# EasyEDA Pro project ZYNQ7020核心板配套底板1.0.epro, schematic 底板原理图

## Sheets
1 PWR: Board Name: 核心板底板1.0; Create Date: 2025-05-13; Page Name: PWR; Project Name: ZYNQ7020核心板配套底板1.0; Schematic Name: 底板原理图; Update Date: 2025-05-18; Company: 嘉立创EDA; Page Size: A4; Version: V1.0
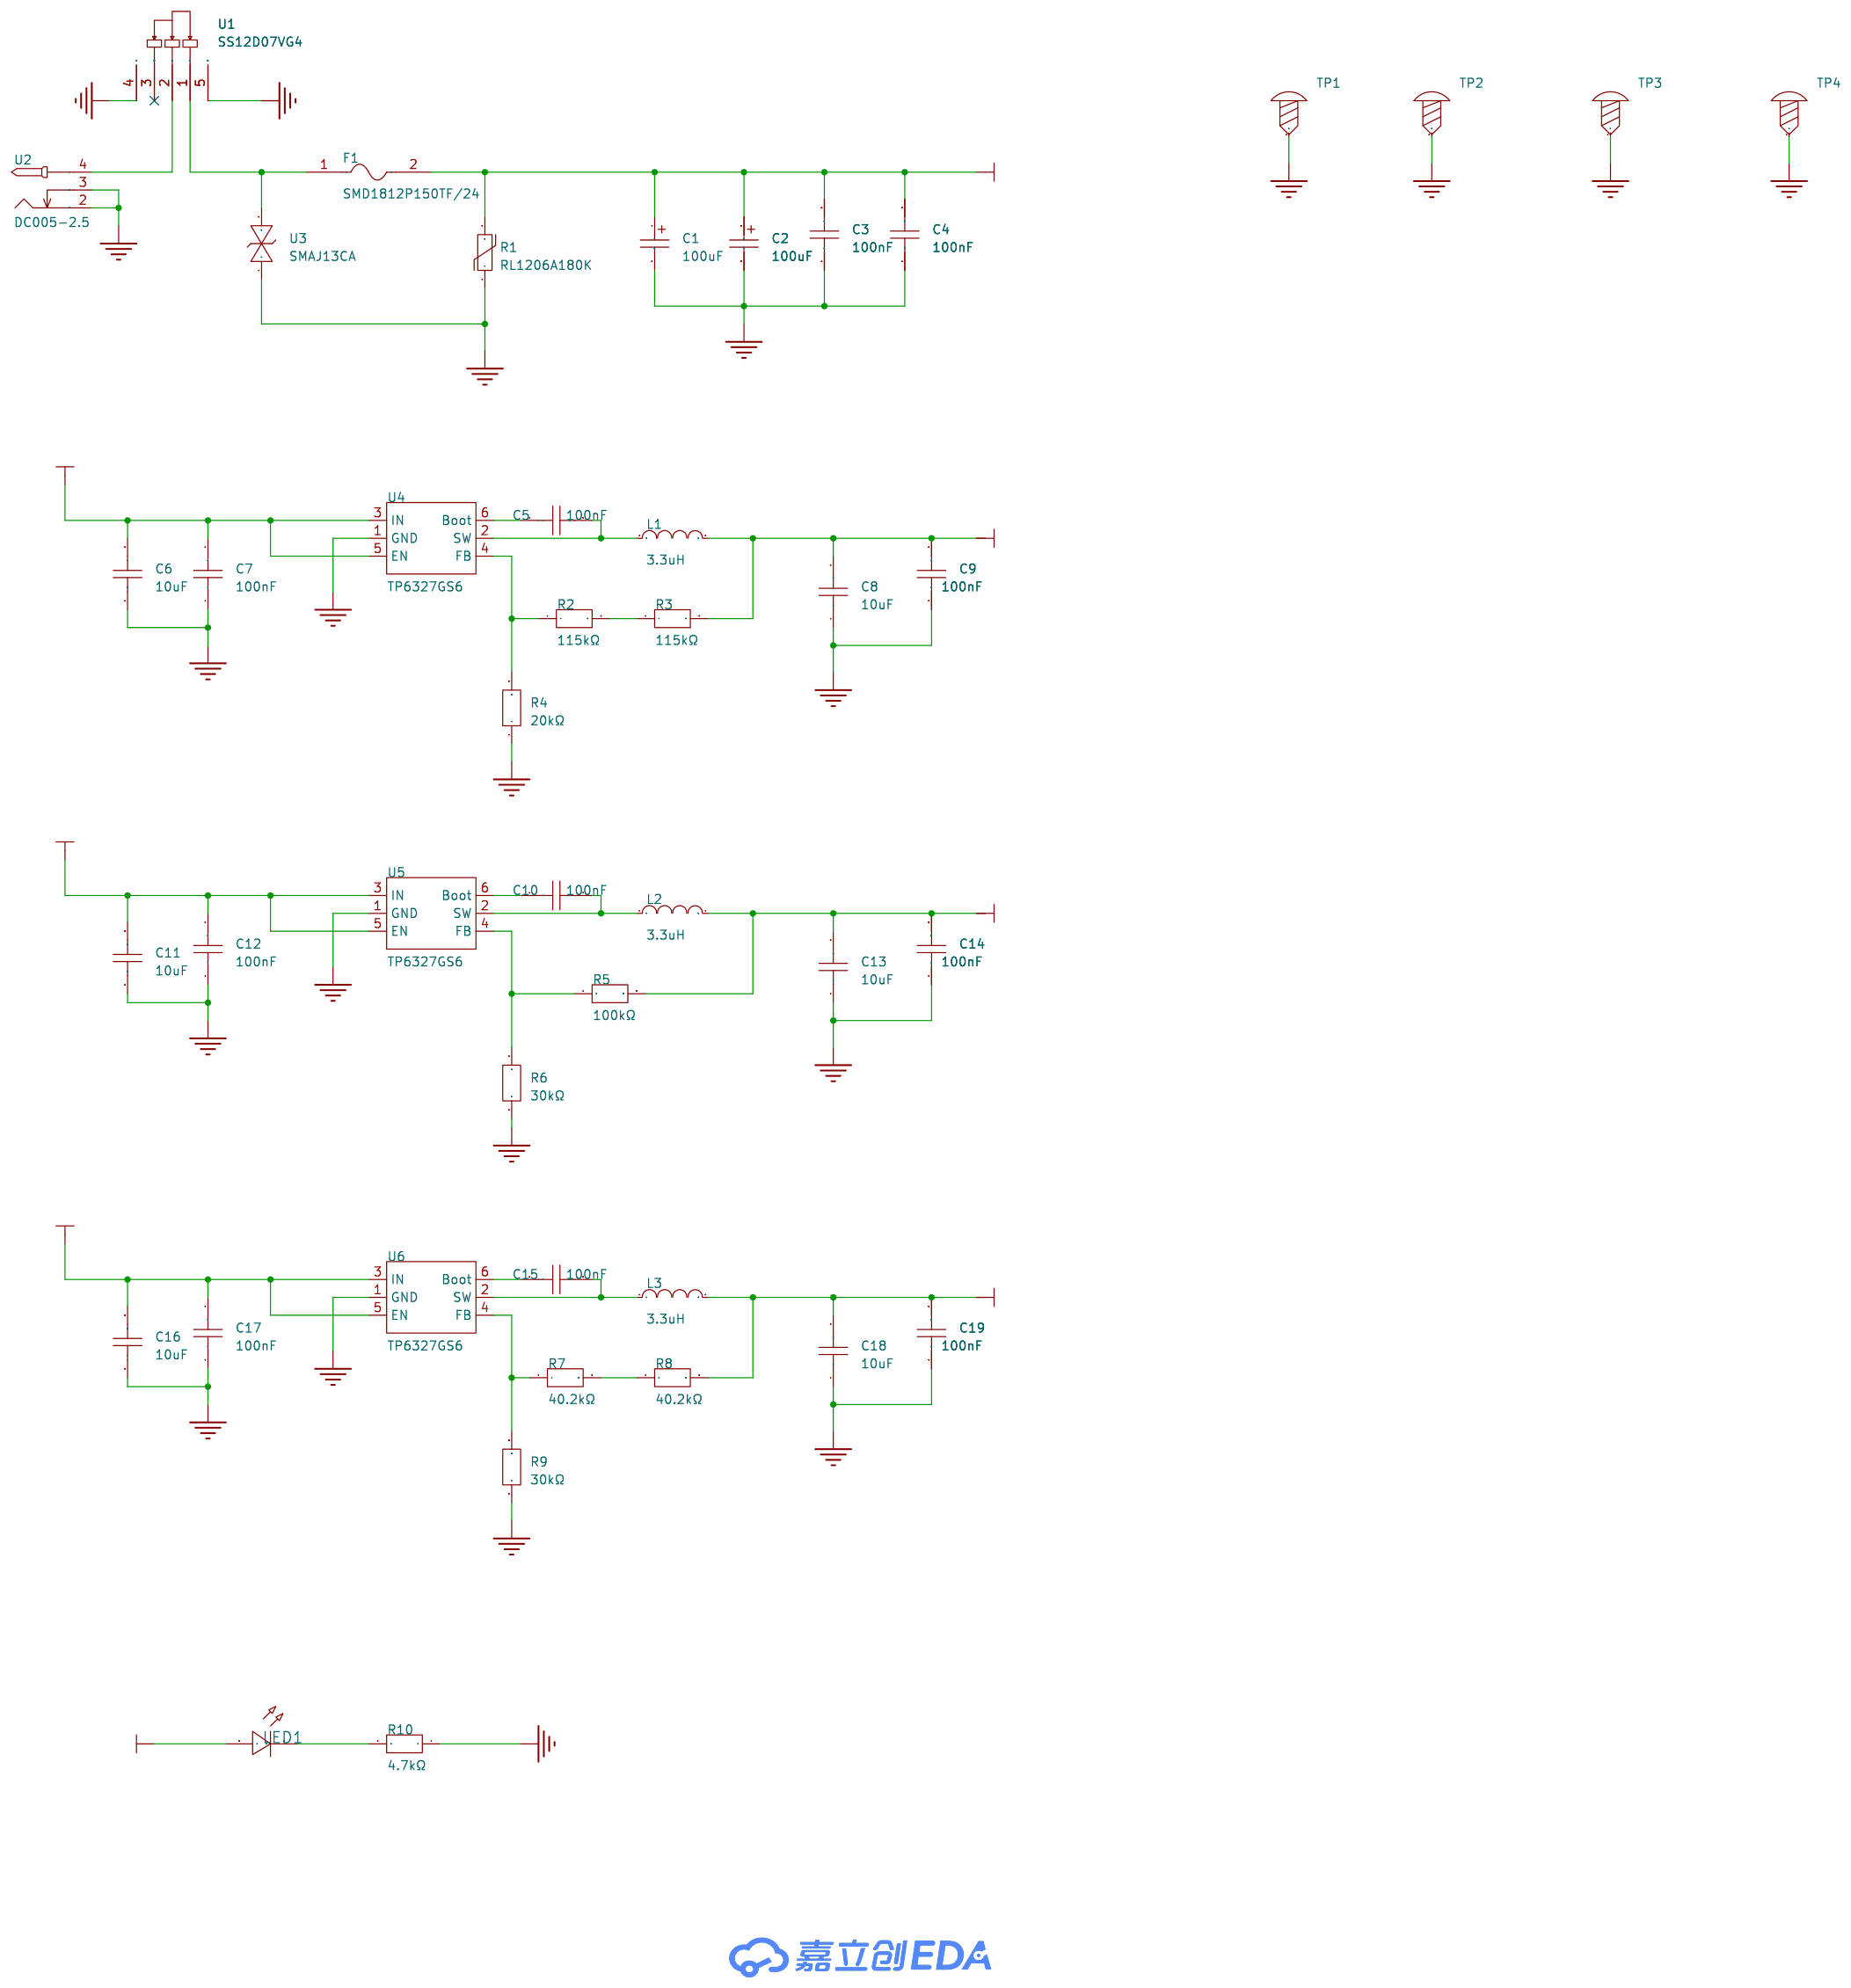
[diagram p0: PWR]
2 esp32: Page Name: esp32; Update Date: 2025-05-19; Company: 知行创新实验室; Drawed: zhz
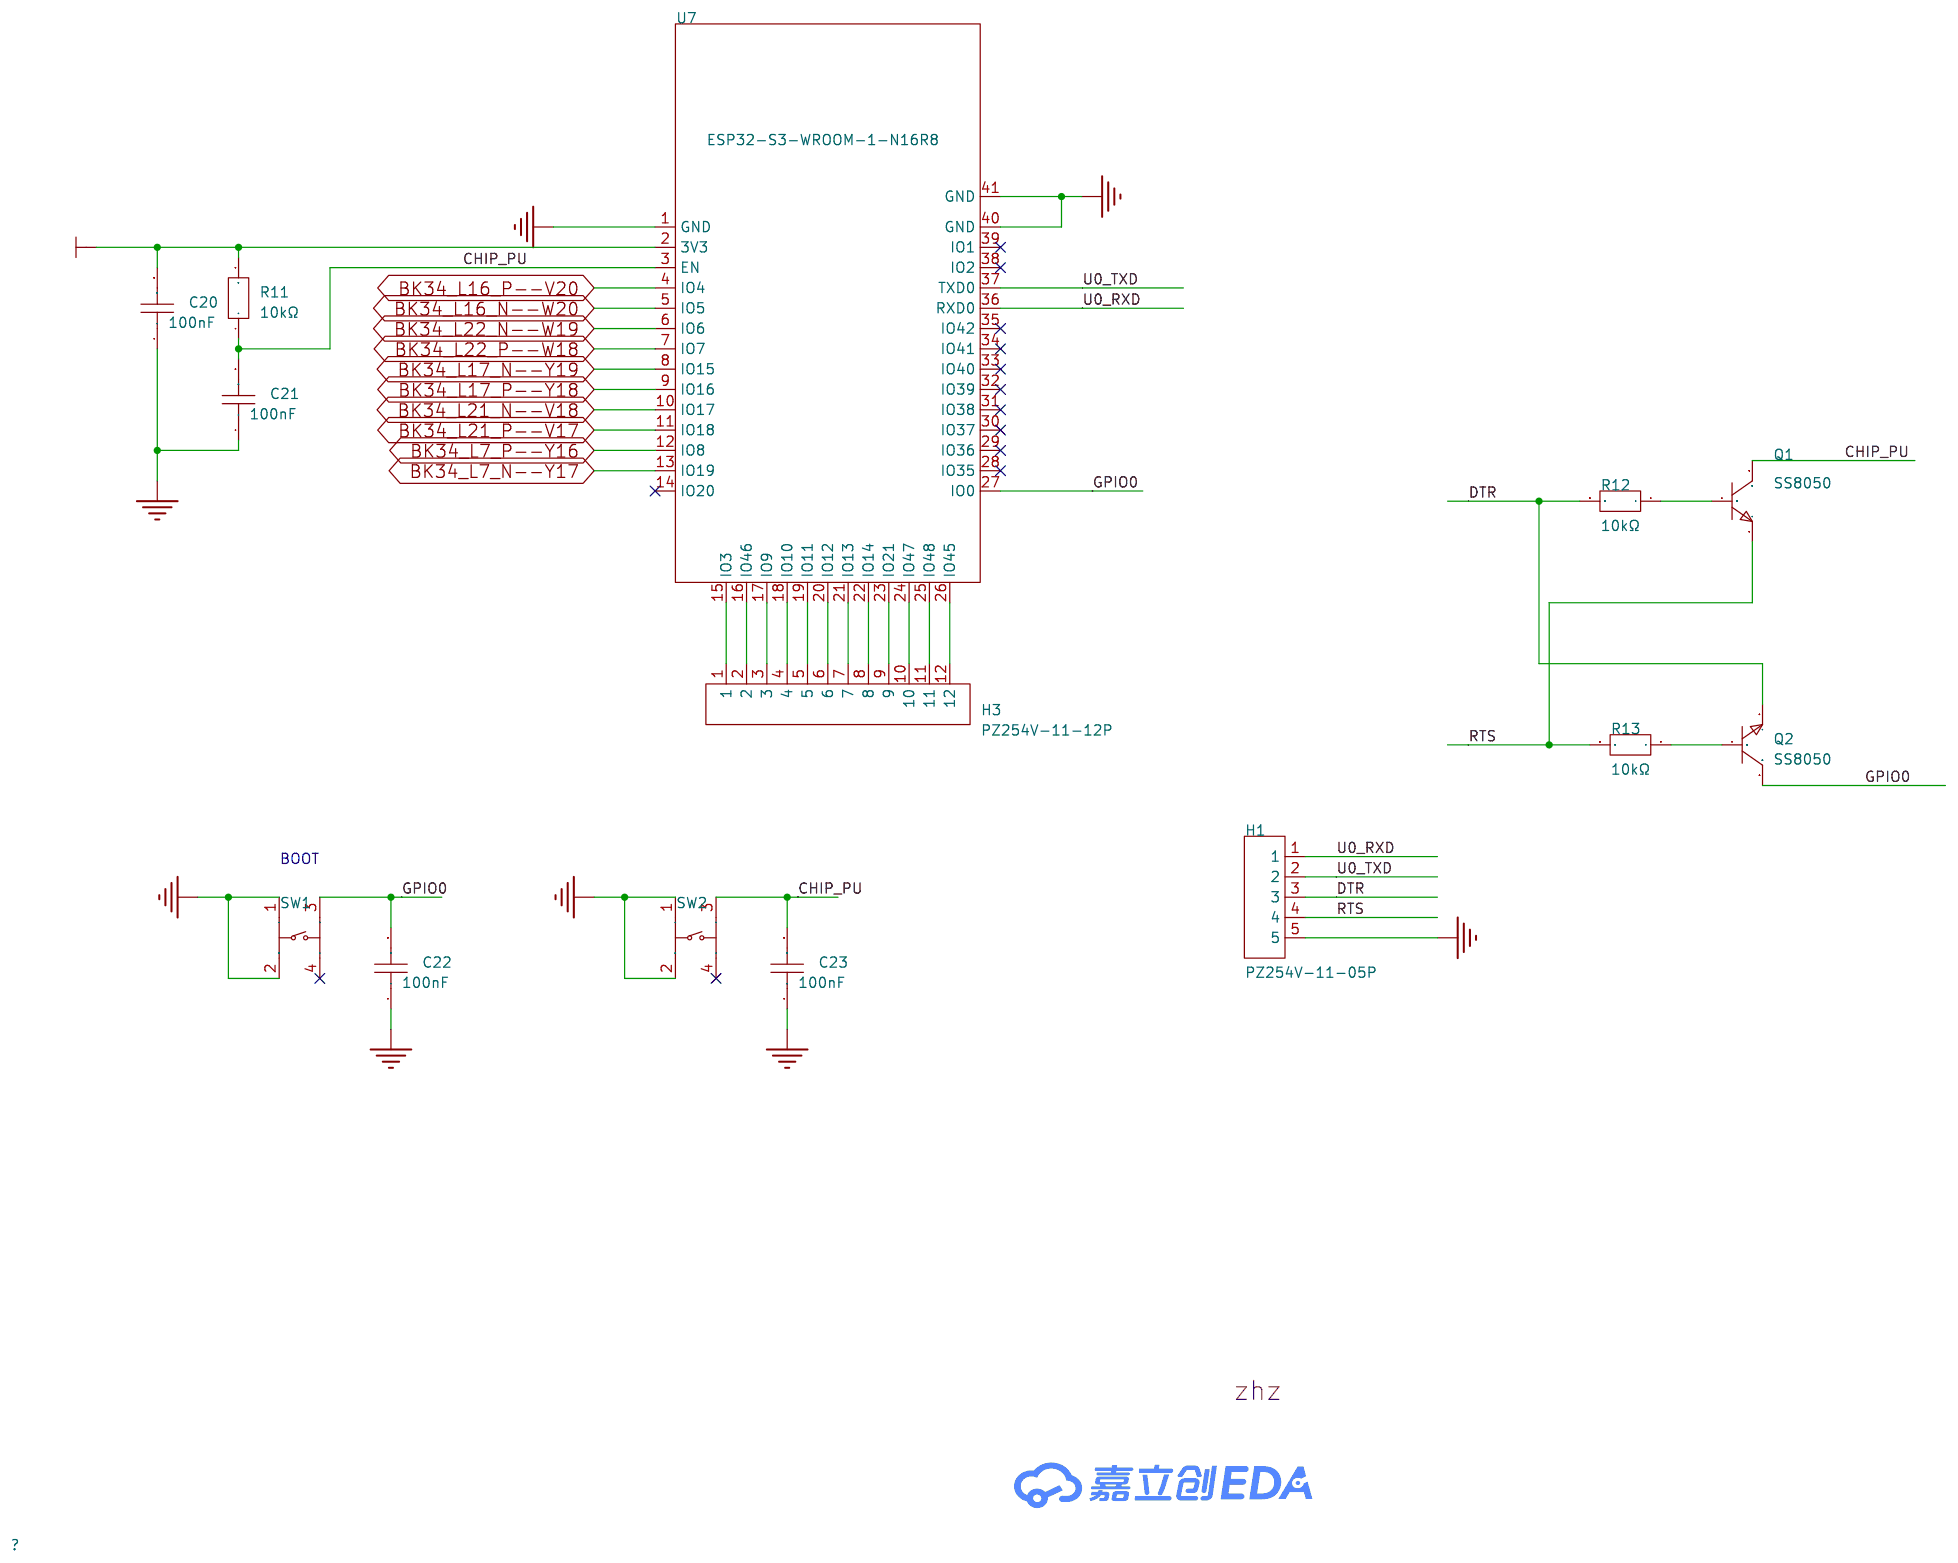
[diagram p1: esp32]
3 zynq: Page Name: zynq; Update Date: 2025-05-19
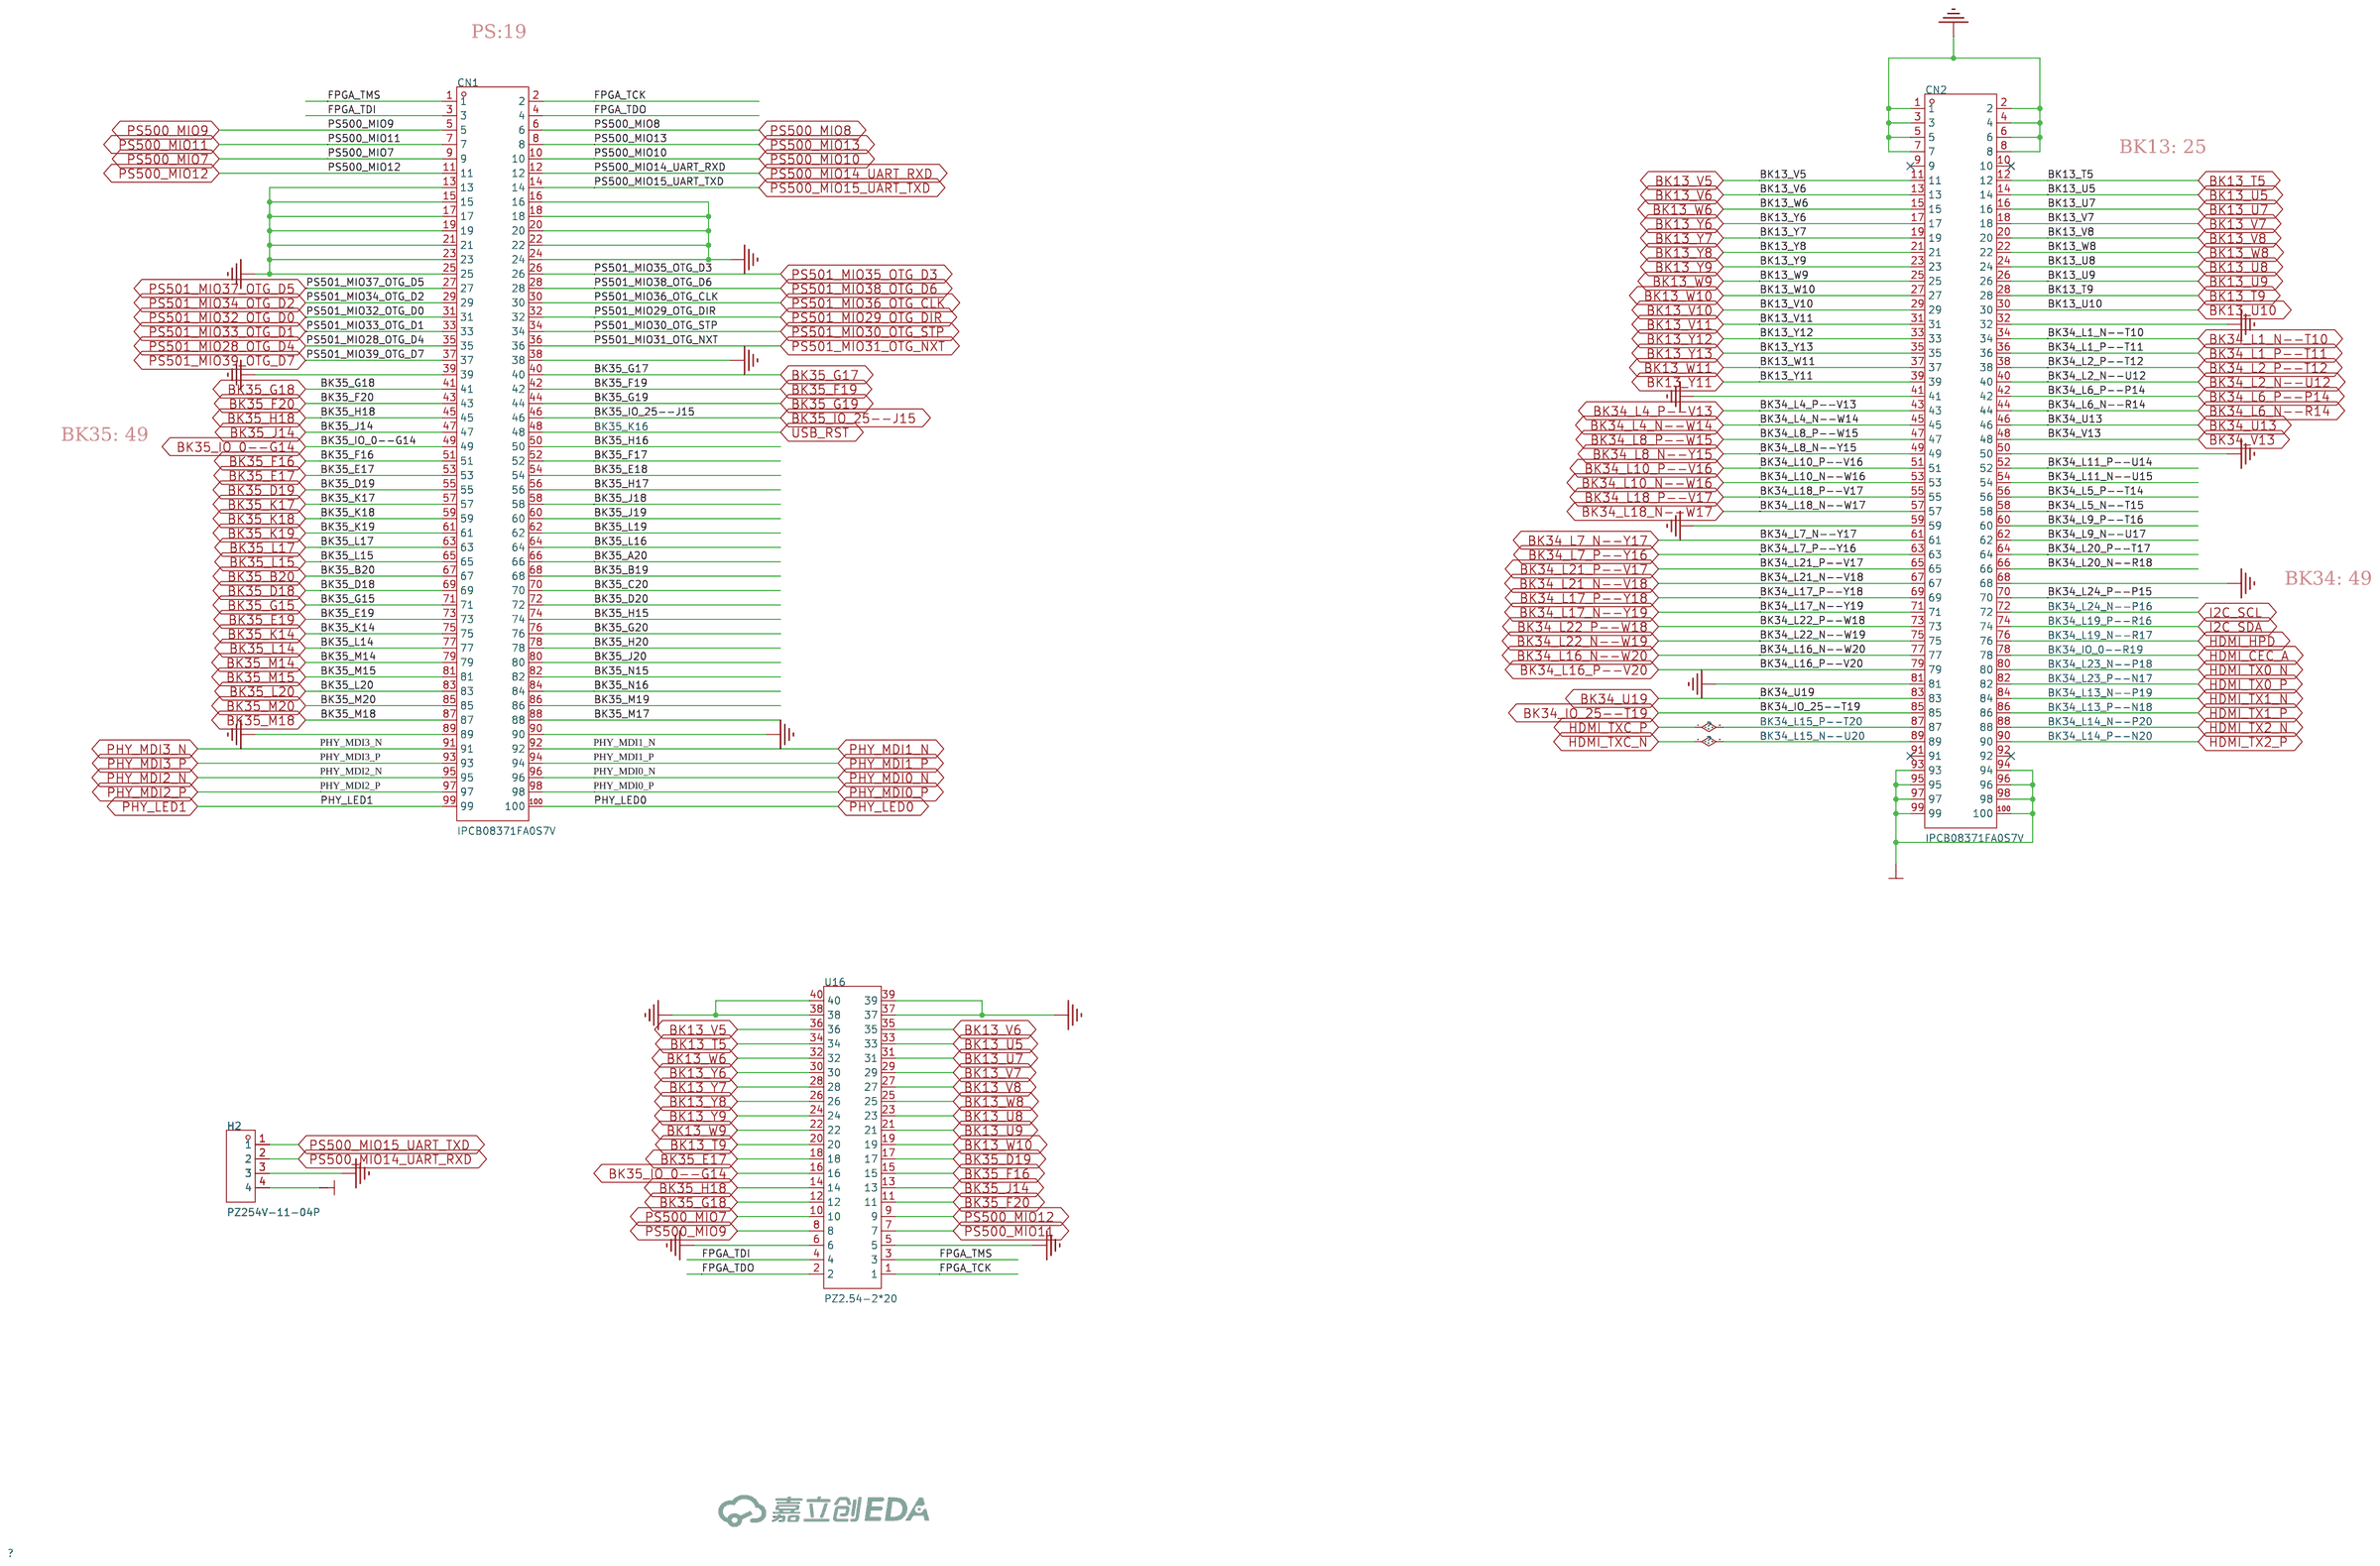
[diagram p2: zynq]
4 eth: Page Name: eth; Update Date: 2025-05-13
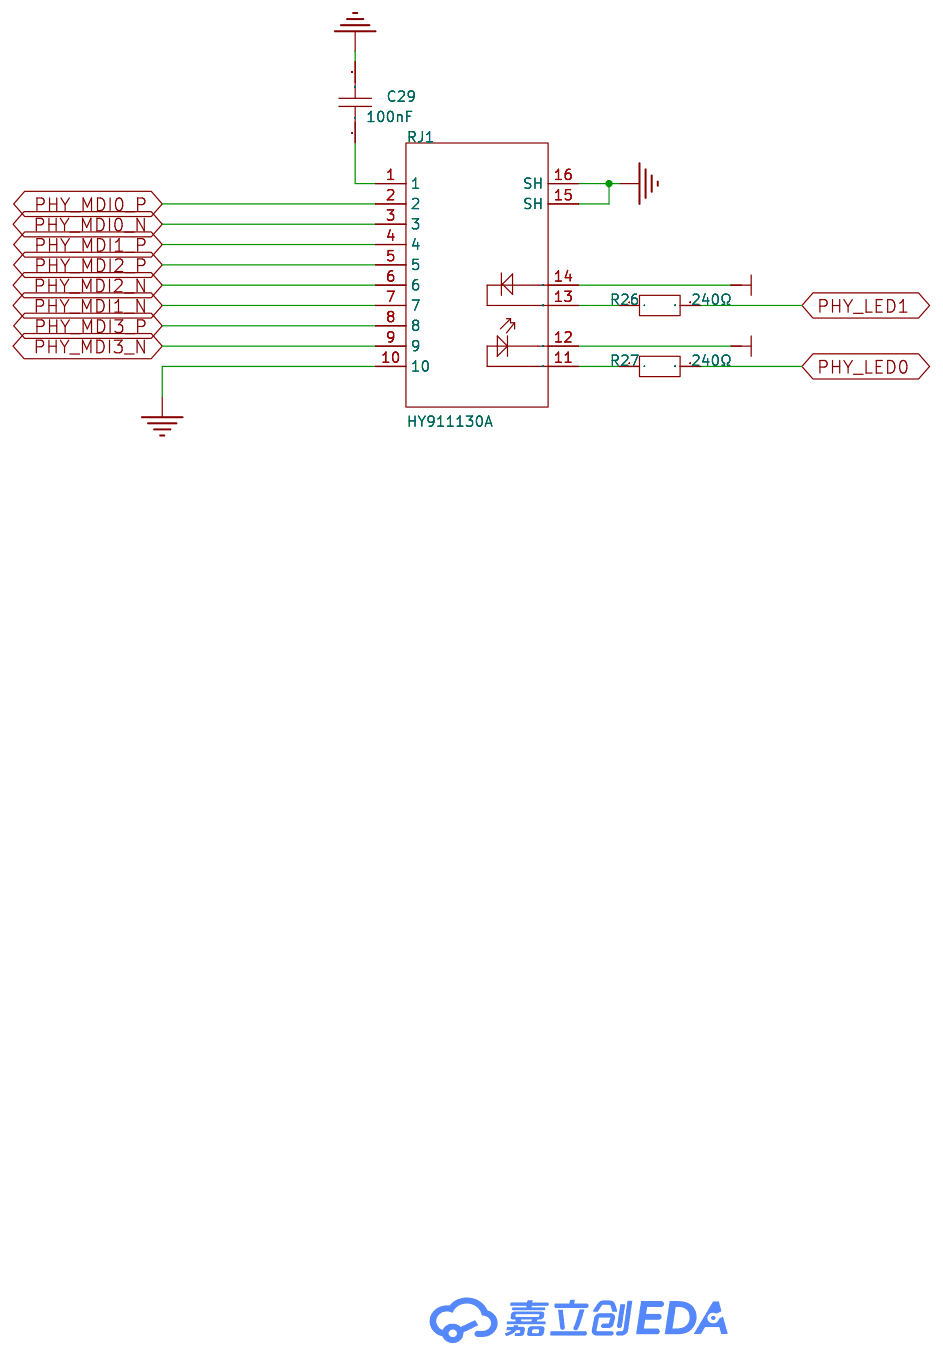
[diagram p3: eth]
5 usb2.0: Page Name: usb2.0
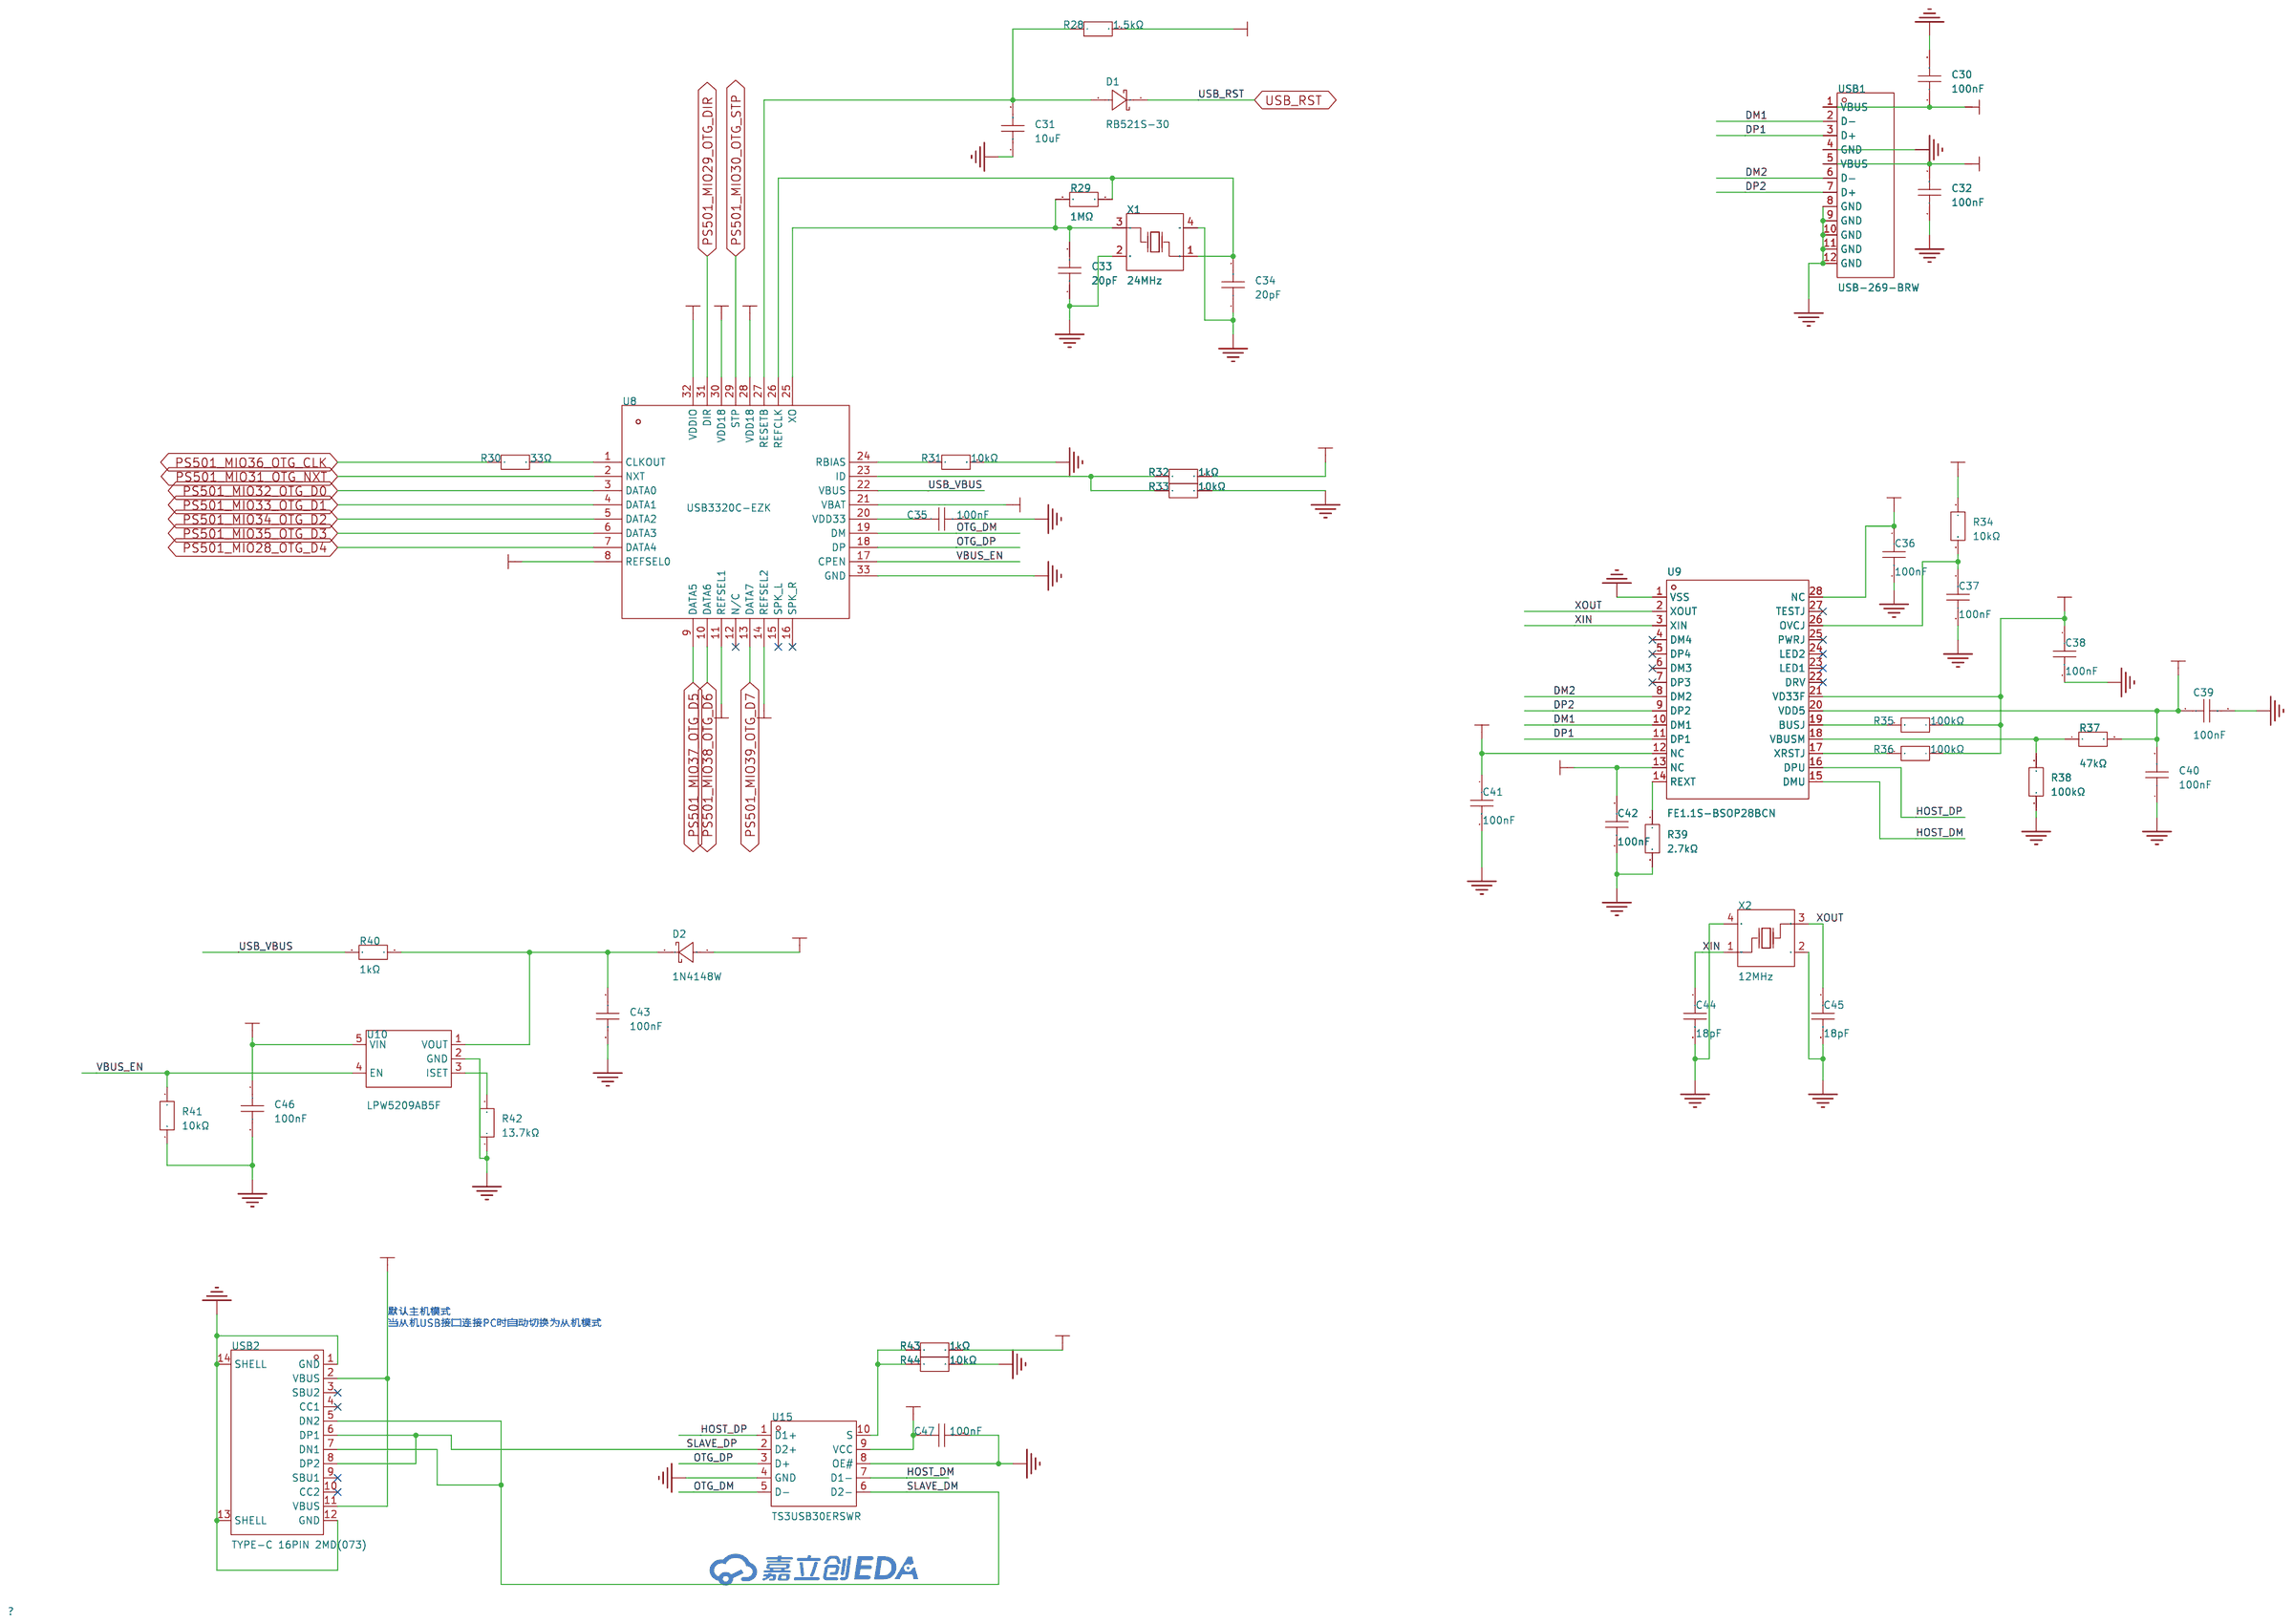
[diagram p4: usb2.0]
6 hdmi: Page Name: hdmi; Update Date: 2025-05-15
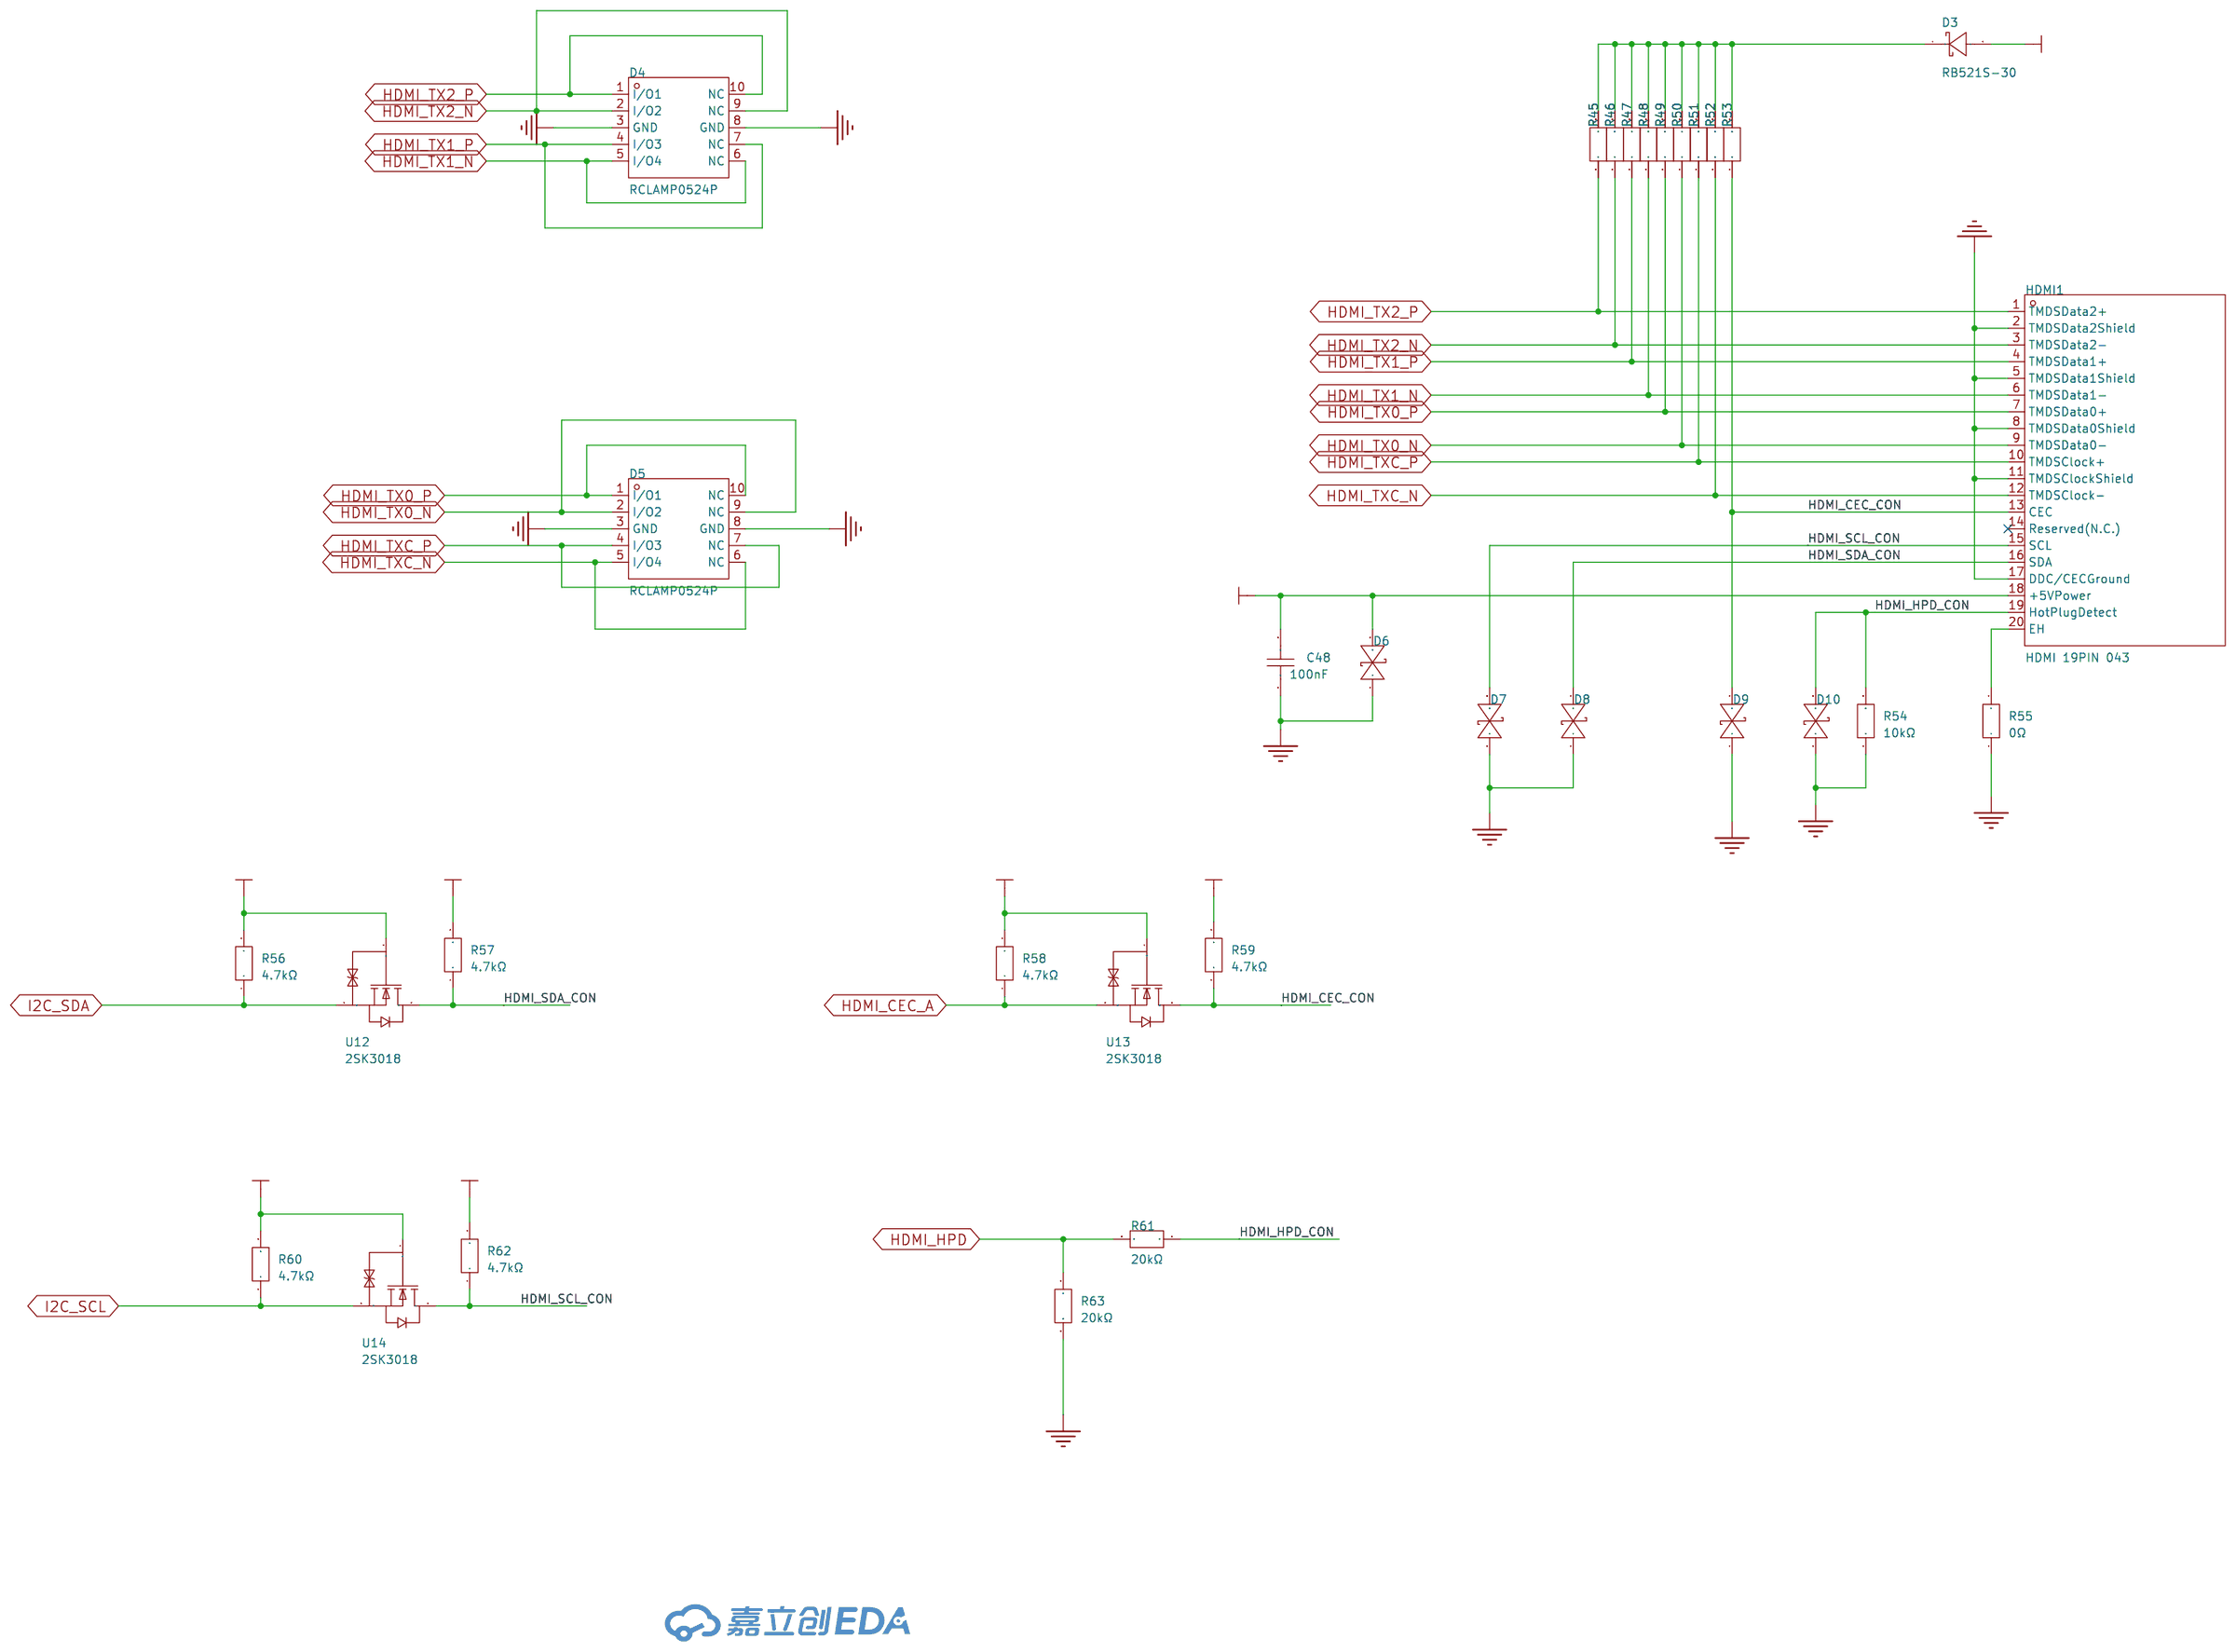
[diagram p5: hdmi]
7 tft-1.47: Page Name: tft-1.47; Update Date: 2025-05-13; Company: 知行创新实验室; Drawed: ZHZ
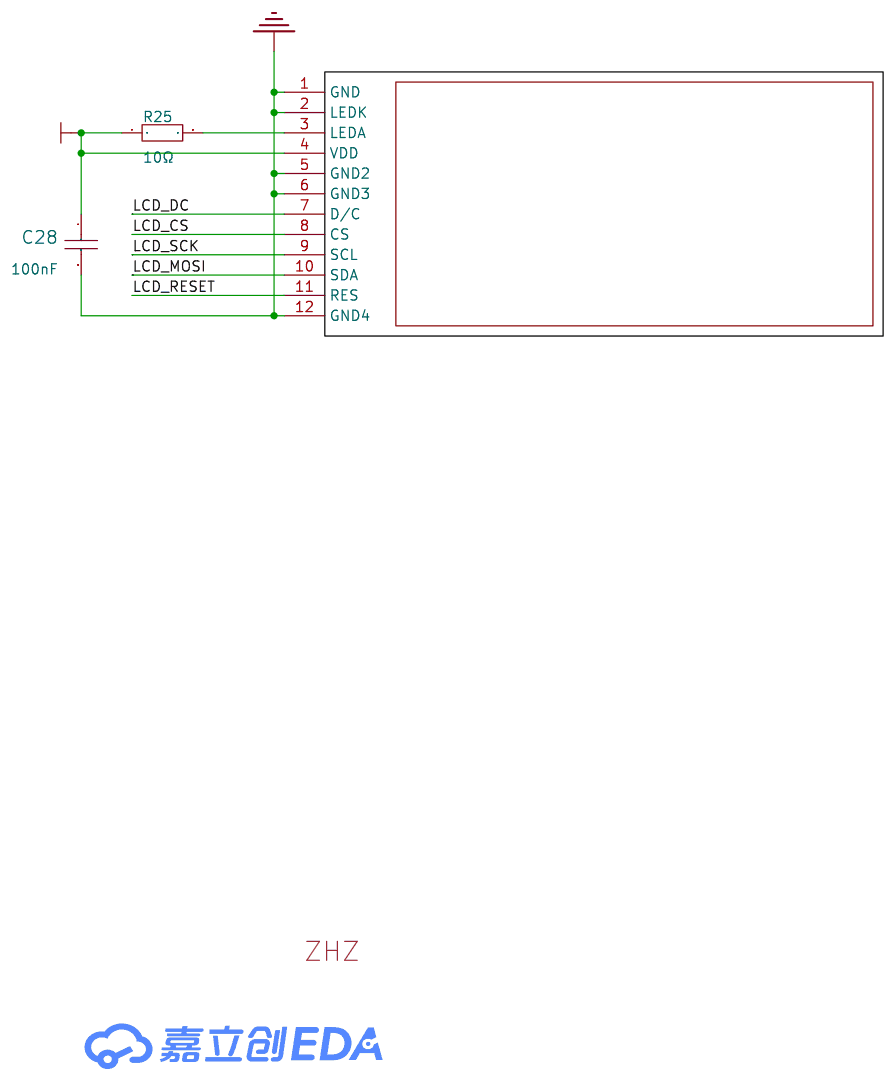
[diagram p6: tft-1.47]
8 key-led: Page Name: key-led; Update Date: 2025-05-19
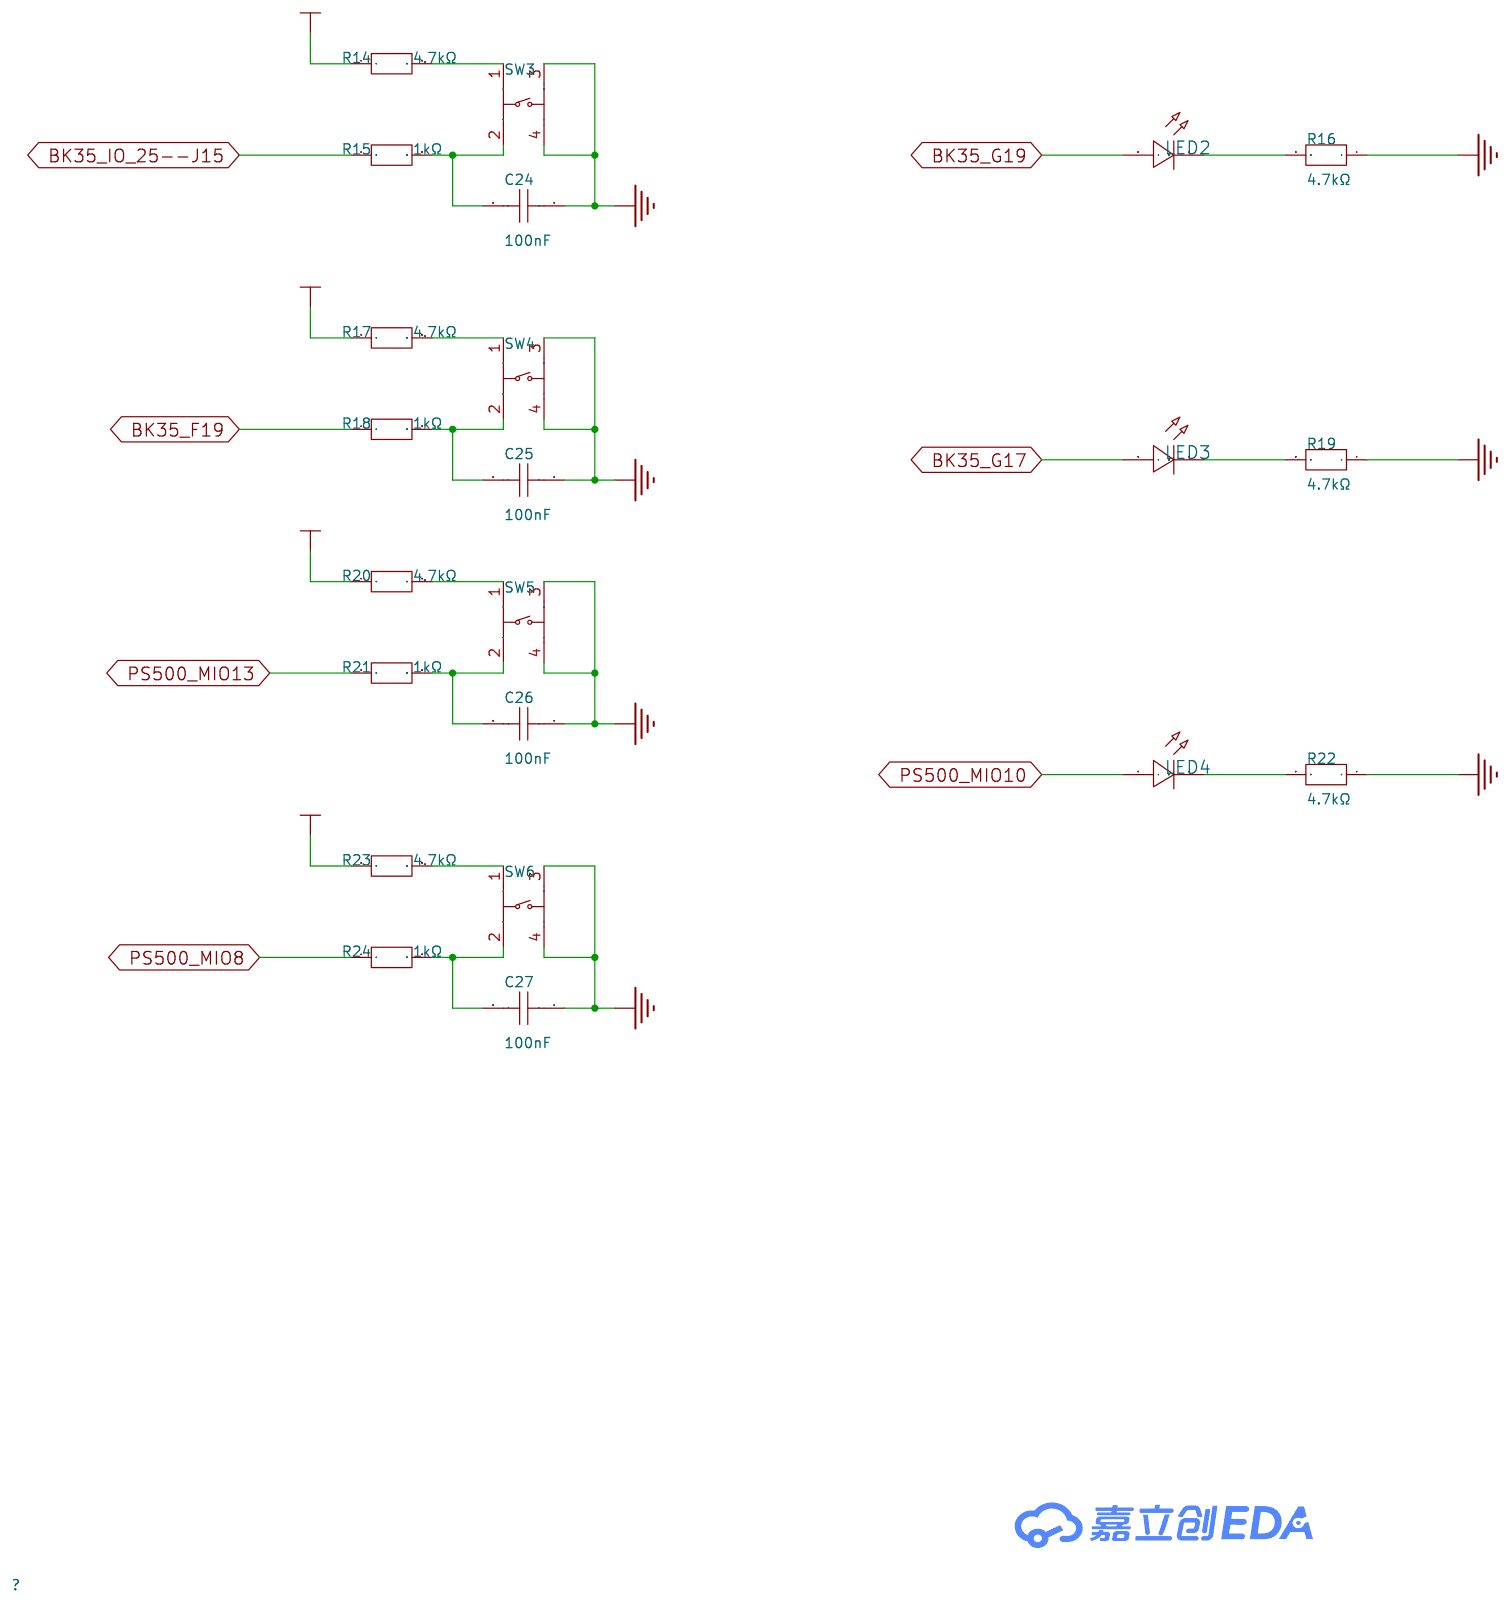
[diagram p7: key-led]
9 P9: Create Date: 2025-05-19
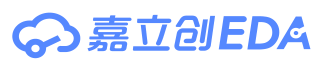
[diagram p8: P9]

## Parts
sheet esp32
C20  100nF  [C0603]
C21  100nF  [C0603]
C22  100nF  [C0603]
C23  100nF  [C0603]
H1  PZ254V-11-05P  [HDR-TH_5P-P2.54-V-M]
H3  PZ254V-11-12P  [HDR-TH_12P-P2.54-V-M]
Q1  SS8050  [SOT-23-3_L2.9-W1.3-P1.90-LS2.4-BR]
Q2  SS8050  [SOT-23-3_L2.9-W1.3-P1.90-LS2.4-BR]
R11  10kΩ  [R0603]
R12  10kΩ  [R0603]
R13  10kΩ  [R0603]
SW1  TS-KG89S-AT25F  [SW-SMD_4P-L4.2-W3.3-P2.15-LS5.1]
SW2  TS-KG89S-AT25F  [SW-SMD_4P-L4.2-W3.3-P2.15-LS5.1]
U7  ESP32-S3-WROOM-1-N16R8  [WIRELM-SMD_ESP32-S3-WROOM-1]
sheet eth
C29  100nF  [C0603]
R26  240Ω  [R0402]
R27  240Ω  [R0402]
RJ1  HY911130A  [RJ45-TH_10P-P2.54-S2.54_L16.1-W21.4_HY911130A]
sheet hdmi
C48  100nF  [C0603]
D3  RB521S-30  [SOD-523_L1.2-W0.8-LS1.6-RD]
D4  RCLAMP0524P  [DFN2510-10_L2.5-W1.0-P0.50-BL]
D5  RCLAMP0524P  [DFN2510-10_L2.5-W1.0-P0.50-BL]
D6  TPESD5B5.0ST1G  [SOD-523_L1.2-W0.8-LS1.6-BI]
D7  TPESD5B5.0ST1G  [SOD-523_L1.2-W0.8-LS1.6-BI]
D8  TPESD5B5.0ST1G  [SOD-523_L1.2-W0.8-LS1.6-BI]
D9  TPESD5B5.0ST1G  [SOD-523_L1.2-W0.8-LS1.6-BI]
D10  TPESD5B5.0ST1G  [SOD-523_L1.2-W0.8-LS1.6-BI]
HDMI1  HDMI 19PIN 043  [HDMI-SMD_HDMI-19PIN-043]
R45  49.9Ω  [R0402]
R46  49.9Ω  [R0402]
R47  49.9Ω  [R0402]
R48  49.9Ω  [R0402]
R49  49.9Ω  [R0402]
R50  49.9Ω  [R0402]
R51  49.9Ω  [R0402]
R52  49.9Ω  [R0402]
R53  49.9Ω  [R0402]
R54  10kΩ  [R0603]
R55  0Ω  [R0603]
R56  4.7kΩ  [R0603]
R57  4.7kΩ  [R0603]
R58  4.7kΩ  [R0603]
R59  4.7kΩ  [R0603]
R60  4.7kΩ  [R0603]
R61  20kΩ  [R0603]
R62  4.7kΩ  [R0603]
R63  20kΩ  [R0603]
U12  2SK3018  [SOT-23-3_L2.9-W1.3-P0.95-LS2.4-BR]
U13  2SK3018  [SOT-23-3_L2.9-W1.3-P0.95-LS2.4-BR]
U14  2SK3018  [SOT-23-3_L2.9-W1.3-P0.95-LS2.4-BR]
sheet key-led
C24  100nF  [C0603]
C25  100nF  [C0603]
C26  100nF  [C0603]
C27  100nF  [C0603]
LED2  -  [LED_0603]
LED3  -  [LED_0603]
LED4  -  [LED_0603]
R14  4.7kΩ  [R0603]
R15  1kΩ  [R0603]
R16  4.7kΩ  [R0603]
R17  4.7kΩ  [R0603]
R18  1kΩ  [R0603]
R19  4.7kΩ  [R0603]
R20  4.7kΩ  [R0603]
R21  1kΩ  [R0603]
R22  4.7kΩ  [R0603]
R23  4.7kΩ  [R0603]
R24  1kΩ  [R0603]
SW3  TS-KG89S-AT25F  [SW-SMD_4P-L4.2-W3.3-P2.15-LS5.1]
SW4  TS-KG89S-AT25F  [SW-SMD_4P-L4.2-W3.3-P2.15-LS5.1]
SW5  TS-KG89S-AT25F  [SW-SMD_4P-L4.2-W3.3-P2.15-LS5.1]
SW6  TS-KG89S-AT25F  [SW-SMD_4P-L4.2-W3.3-P2.15-LS5.1]
sheet PWR
C1  100uF  [CASE-D_7343]
C2  100uF  [CASE-D_7343]
C3  100nF  [C0805]
C4  100nF  [C0805]
C5  100nF  [C0603]
C6  10uF  [C0603]
C7  100nF  [C0603]
C8  10uF  [C0603]
C9  100nF  [C0603]
C10  100nF  [C0603]
C11  10uF  [C0603]
C12  100nF  [C0603]
C13  10uF  [C0603]
C14  100nF  [C0603]
C15  100nF  [C0603]
C16  10uF  [C0603]
C17  100nF  [C0603]
C18  10uF  [C0603]
C19  100nF  [C0603]
F1  SMD1812P150TF/24  [F1812]
L1  3.3uH  [IND-SMD_L4.4-W4.2-A]
L2  3.3uH  [IND-SMD_L4.4-W4.2-A]
L3  3.3uH  [IND-SMD_L4.4-W4.2-A]
LED1  -  [LED_0603]
R1  RL1206A180K  [R1206]
R2  115kΩ  [R0603]
R3  115kΩ  [R0603]
R4  20kΩ  [R0603]
R5  100kΩ  [R0603]
R6  30kΩ  [R0603]
R7  40.2kΩ  [R0603]
R8  40.2kΩ  [R0603]
R9  30kΩ  [R0603]
R10  4.7kΩ  [R0603]
TP1  -  [M3螺丝]
TP2  -  [M3螺丝]
TP3  -  [M3螺丝]
TP4  -  [M3螺丝]
U1  SS12D07VG4  [SW-TH_SS12D07VG4]
U2  DC005-2.5  [DC-IN-TH_DC005-2.5MM]
U3  SMAJ13CA  [DO-214AC_L4.3-W2.7-LS5.0-BI]
U4  TP6327GS6  [SOT-23-6_L2.9-W1.6-P0.95-LS2.8-BL]
U5  TP6327GS6  [SOT-23-6_L2.9-W1.6-P0.95-LS2.8-BL]
U6  TP6327GS6  [SOT-23-6_L2.9-W1.6-P0.95-LS2.8-BL]
sheet tft-1.47
C28  100nF  [C0402]  (no BOM)
LCD1  -  [ST7789V3-1.47寸焊接]  (no BOM)
R25  10Ω  [R0402_2]  (no BOM)
sheet usb2.0
C30  100nF  [C0603]
C31  10uF  [C0603]
C32  100nF  [C0603]
C33  20pF  [C0603]
C34  20pF  [C0603]
C35  100nF  [C0603]
C36  100nF  [C0603]
C37  100nF  [C0603]
C38  100nF  [C0603]
C39  100nF  [C0603]
C40  100nF  [C0603]
C41  100nF  [C0603]
C42  100nF  [C0603]
C43  100nF  [C0603]
C44  18pF  [C0603]
C45  18pF  [C0603]
C46  100nF  [C0603]
C47  100nF  [C0603]
D1  RB521S-30  [SOD-523_L1.2-W0.8-LS1.6-RD]
D2  1N4148W  [SOD-123_L2.7-W1.6-LS3.7-FD]
R28  1.5kΩ  [R0402]
R29  1MΩ  [R0603]
R30  33Ω  [R0402]
R31  10kΩ  [R0402]
R32  1kΩ  [R0402]
R33  10kΩ  [R0402]
R34  10kΩ  [R0603]
R35  100kΩ  [R0603]
R36  100kΩ  [R0603]
R37  47kΩ  [R0603]
R38  100kΩ  [R0603]
R39  2.7kΩ  [R0603]
R40  1kΩ  [R0603]
R41  10kΩ  [R0603]
R42  13.7kΩ  [R0603]
R43  1kΩ  [R0402]
R44  10kΩ  [R0402]
U8  USB3320C-EZK  [QFN-32_L5.0-W5.0-P0.50-BL-EP3.4]
U9  FE1.1S-BSOP28BCN  [SSOP-28_L9.9-W3.9-P0.635-LS6.0-BL-1]
U10  LPW5209AB5F  [SOT-23-5_L3.0-W1.7-P0.95-LS2.8-BL]
U15  TS3USB30ERSWR  [UQFN-10_L1.8-W1.4-P0.40-TL]
USB1  USB-269-BRW  [USB-A-TH_USB-269-BRW]
USB2  TYPE-C 16PIN 2MD(073)  [USB-C-SMD_TYPE-C-6PIN-2MD-073]
X1  24MHz  [CRYSTAL-SMD_4P-L3.2-W2.5-BL]
X2  12MHz  [CRYSTAL-SMD_4P-L3.2-W2.5-BL]
sheet zynq
CN1  IPCB08371FA0S7V  [CONN-SMD_100P-P0.80_10144517-103XXX]
CN2  IPCB08371FA0S7V  [CONN-SMD_100P-P0.80_10144517-103XXX]
H2  PZ254V-11-04P  [HDR-TH_4P-P2.54-V-M]
U16  PZ2.54-2*20  [HDR-TH_40P-P2.54-V-M-R2-C20-S2.54]

## Library data of the parts
C5-C27 C29 C48 = FCC0603B104K500CT: 容值:100nF;精度:±10%;额定电压:50V;温度系数:X7R;; LCSC Part Name: 100nF ±10% 50V; Supplier Part: C5137636; Manufacturer: FOJAN(富捷); Supplier Footprint: 0603; JLCPCB Part Class: 扩展库; Datasheet: https://atta.szlcsc.com/upload/public/pdf/source/20220818/0EB3B7FB2F5648AC16609637FBA7DABE.pdf; Supplier: LCSC; Tolerance: ±10%; Voltage Rating: 50V; Temperature Coefficient: X7R
H1 = PZ254V-11-05P: 插针结构:1x5P;间距:2.54mm;行距:-;圆针/方针:方针;安装方式:直插;排数:单排;总PIN位数:5P;额定电流:-;额定电压:-;配合针长度:6mm;塑高:2.5mm;端接针长度:3mm;触头材质:黄铜;触头镀层:-;工作温度:-40℃~+105℃;颜色:黑色;; LCSC Part Name: 1x5P 间距:2.54mm 方针 直插; Supplier Part: C492404; Manufacturer: XFCN(兴飞); Supplier Footprint: 插件,P=2.54mm; JLCPCB Part Class: 扩展库; Datasheet: https://atta.szlcsc.com/upload/public/pdf/source/20200309/C492404_E51533260F8710EFF5D4617281164C1D.pdf; Supplier: LCSC; Pin Structure: 1x5P; Pitch: 2.54mm; Circluar Pins/Square Pins: 方针; Mounting Type: 直插; Number of Rows: 单排; Number of Pins: 5P; Length of Mating Pin: 6mm; Insulation Height: 2.5mm; Length of End Connection Pin: 3mm; Contact Material: 黄铜; Operating Temperature: -40℃~+105℃; Color: 黑色
H3 = PZ254V-11-12P: 插针结构:1x12P;间距:2.54mm;行距:-;圆针/方针:方针;安装方式:直插;排数:单排;总PIN位数:12P;额定电流:3A;额定电压:250V;配合针长度:6mm;塑高:2.5mm;端接针长度:3mm;触头材质:-;工作温度:-40℃~+105℃;颜色:黑色;; LCSC Part Name: 1x12P 间距:2.54mm 方针 直插; Supplier Part: C2840012; Manufacturer: XFCN(兴飞); Supplier Footprint: 插件,P=2.54mm; JLCPCB Part Class: 扩展库; Datasheet: https://atta.szlcsc.com/upload/public/pdf/source/20200309/C492403_F9F19131791D08044AD4F84F8E751A34.pdf; Supplier: LCSC; Pin Structure: 1x12P; Pitch: 2.54mm; Circluar Pins/Square Pins: 方针; Mounting Type: 直插; Number of Rows: 单排; Number of Pins: 12P; Current Rating: 3A; Voltage Rating (Max): 250V; Length of Mating Pin: 6mm; Insulation Height: 2.5mm; Length of End Connection Pin: 3mm; Operating Temperature: -40℃~+105℃; Color: 黑色
Q1 Q2 = SS8050_C7420370: 晶体管类型:NPN;集电极电流(Ic):1.5A;集射极击穿电压(Vceo):25V;耗散功率(Pd):300mW;直流电流增益(hFE):120@100mA,1.0V;; LCSC Part Name: H档 200-350; Supplier Part: C7420370; Manufacturer: 宏嘉诚; Supplier Footprint: SOT-23; JLCPCB Part Class: 扩展库; Datasheet: https://atta.szlcsc.com/upload/public/pdf/source/20250205/5DB94E86981B5B1A1866D18E379C0D4F.pdf; Supplier: LCSC; type: NPN; Current - Collector(Ic): 1.5A; Collector - Emitter Voltage VCEO: 25V; Pd - Power Dissipation: 300mW; DC Current Gain: 120@100mA,1.0V; Transition frequency(fT): 100MHz; Current - Collector Cutoff: 100nA; Vce Saturation(VCE(sat)): 500mV; Operating Temperature: -55℃~+150℃
R2-R24 R28 R30-R33 R40-R44 R54-R63 = FRC0603F2002TS: 电阻类型:厚膜电阻;阻值:20kΩ;精度:±1%;功率:100mW;最大工作电压:75V;温度系数:±100ppm/℃;; LCSC Part Name: 20kΩ ±1% 100mW 厚膜电阻; Supplier Part: C2907011; Manufacturer: FOJAN(富捷); Supplier Footprint: 0603; JLCPCB Part Class: 扩展库; Datasheet: https://atta.szlcsc.com/upload/public/pdf/source/20211221/925EC7D7225764EE0046F22065062C87.pdf; Supplier: LCSC; Type: 厚膜电阻; Tolerance: ±1%; Power(Watts): 100mW; Overload Voltage (Max): 75V; Temperature Coefficient: ±100ppm/℃; Operating Temperature Range: -55℃~+155℃
SW1-SW6 = TS-KG89S-AT25F: 电路结构:单刀单掷;按钮形状:椭圆形按钮;作用力:250gf;安装方式:立贴;开关长度:4.2mm;开关宽度:3.25mm;开关高度:2.5mm;带支架:不带;触点电流:50mA;额定电压(DC):12V;绝缘电阻:100MΩ;机械寿命:10万次;; LCSC Part Name: 4.2*3.25*2.5mm 立贴 轻触开关; Supplier Part: C2874599; Manufacturer: HANBO(汉博); Supplier Footprint: SMD; Datasheet: https://atta.szlcsc.com/upload/public/pdf/source/20221110/0D75E68DCC1CEC2670E8A2B9A9134A65.pdf; Supplier: LCSC; Circuit: 单刀单掷; Actuator Style: 椭圆形按钮; Operating Force: 250gf; Mounting Style: 立贴; Switch Length: 4.2mm; Switch Width: 3.25mm; Switch Height: 2.5mm; Strike Gundam: 不带; Contact Current: 50mA; Voltage Rating (DC): 12V; Insulation Resistance: 100MΩ; Actuator/Cap Color: 白色; Pin Style: SMD接片; Mechanical Life: 10万次
U7 = ESP32-S3-WROOM-1-N16R8: LCSC Part Name: 通用型Wi-Fi+低功耗蓝牙MCU模组; Supplier Part: C2913202; Manufacturer: ESPRESSIF(乐鑫); Supplier Footprint: SMD,18x25.5mm; JLCPCB Part Class: 扩展库; Datasheet: https://atta.szlcsc.com/upload/public/pdf/source/20241030/6A412B13087E1327DF6279F5735253CA.pdf; Supplier: LCSC
R26 R27 = FRC0402F2400TS: 电阻类型:厚膜电阻;阻值:240Ω;精度:±1%;功率:62.5mW;最大工作电压:50V;温度系数:±100ppm/℃;; LCSC Part Name: 240Ω ±1% 62.5mW 厚膜电阻; Supplier Part: C2909339; Manufacturer: FOJAN(富捷); Supplier Footprint: 0402; JLCPCB Part Class: 扩展库; Datasheet: https://atta.szlcsc.com/upload/public/pdf/source/20211221/925EC7D7225764EE0046F22065062C87.pdf; Supplier: LCSC; Type: 厚膜电阻; Tolerance: ±1%; Power(Watts): 62.5mW; Overload Voltage (Max): 50V; Temperature Coefficient: ±100ppm/℃; Operating Temperature Range: -55℃~+155℃
RJ1 = HY911130A: 连接器类型:RJ45插座;端口数量:1;屏蔽:有屏蔽;LED:带LED;等级:-;; LCSC Part Name: 带LED; Supplier Part: C55679; Manufacturer: HANRUN(汉仁); Supplier Footprint: 插件; Datasheet: https://atta.szlcsc.com/upload/public/pdf/source/20151014/1457707458663.pdf; Supplier: LCSC; Connector Type: RJ45插座; Number of Ports: 1; Shielding: 有屏蔽; LED: 带LED
D1 D3 = RB521S-30_C7502702: 二极管配置:独立式;正向压降(Vf):500mV@200mA;直流反向耐压(Vr):30V;整流电流:200mA;; LCSC Part Name: 电压:30V 电流:200mA; Supplier Part: C7502702; Manufacturer: 宏迦橙; Supplier Footprint: SOD-523; JLCPCB Part Class: 扩展库; Datasheet: https://atta.szlcsc.com/upload/public/pdf/source/20231117/B97501A911E32001469DA948E33C7CD5.pdf; Supplier: LCSC; Diode Configuration: 独立式; Forward Voltage (Vf@If): 500mV@200mA; Reverse Voltage (Vr): 30V; Rectified Current: 200mA; Reverse Leakage Current (Ir): 30uA
D4 D5 = RCLAMP0524P_C907837: 极性:单向;反向截止电压(Vrwm):5V;最大钳位电压:17V;峰值脉冲电流(Ipp):4.5A;击穿电压:6.8V;; Supplier Part: C907837; Manufacturer: TECH PUBLIC(台舟); Supplier Footprint: DFN2510-10; JLCPCB Part Class: 扩展库; Datasheet: https://atta.szlcsc.com/upload/public/pdf/source/20210810/AE3DE9AC94AD2A317FD9BEA10653400F.pdf; Supplier: LCSC; polarity: 单向; Reverse Stand-Off Voltage (Vrwm): 5V; Maximum Clamping Voltage: 17V; Peak Pulse Current (Ipp): 4.5A; Breakdown Voltage: 6.8V; Reverse Leakage Current (Ir): 80nA; Number of Lines: 四路; Operating Temperature: -55℃~+125℃; level of protection: IEC 61000-4-2; Type: ESD
D6-D10 = TPESD5B5.0ST1G: Supplier Part: C558434; Manufacturer: TECH PUBLIC(台舟); Supplier Footprint: SOD-523; JLCPCB Part Class: 扩展库; Datasheet: https://atta.szlcsc.com/upload/public/pdf/source/20200521/C558434_6DE7B8D3245E114A2B3EDEAF4497450B.pdf; Supplier: LCSC; Type: ESD
HDMI1 = HDMI 19PIN 043: USB母座/HD-MI 19PIN母座 4脚插件 贴片19PIN 铁壳镀镍; Supplier Part: C2858275; Manufacturer: SHOU HAN(首韩); Supplier Footprint: SMD; JLCPCB Part Class: 扩展库; Datasheet: https://atta.szlcsc.com/upload/public/pdf/source/20210728/C2858275_DF299413048A9CF092C2A61AB97004F4.pdf; Supplier: LCSC; Connector Type: HDMI-A; Gender: 母; Number of Pins: 19P; Mounting Style: 卧贴; Current Rating (Max): 300mA; Rated Voltage (Max): 40V; Operating Temperature Range: -55℃~+85℃
R45-R53 = FRC0402F49R9TS: 电阻类型:厚膜电阻;阻值:49.9Ω;精度:±1%;功率:62.5mW;最大工作电压:50V;温度系数:±100ppm/℃;; LCSC Part Name: 49.9Ω ±1% 62.5mW 厚膜电阻; Supplier Part: C2933103; Manufacturer: FOJAN(富捷); Supplier Footprint: 0402; JLCPCB Part Class: Extended Part; Datasheet: https://atta.szlcsc.com/upload/public/pdf/source/20211221/925EC7D7225764EE0046F22065062C87.pdf; Supplier: LCSC; Type: 厚膜电阻; Tolerance: ±1%; Power(Watts): 62.5mW; Overload Voltage (Max): 50V; Temperature Coefficient: ±100ppm/℃; Operating Temperature Range: -55℃~+155℃
U12-U14 = 2SK3018_C20069148: 类型:1个N沟道;漏源电压(Vdss):30V;连续漏极电流(Id):100mA;导通电阻(RDS(on)):8Ω@4.0V,10mA;耗散功率(Pd):200mW;阈值电压(Vgs(th)):1.5V;; LCSC Part Name: 1个N沟道 耐压:30V 电流:100mA; Supplier Part: C20069148; Manufacturer: 宏嘉诚; Supplier Footprint: SOT-23; Datasheet: https://atta.szlcsc.com/upload/public/pdf/source/20250106/A20C9231C35F1D1D31168B0F43AE2E87.pdf; Supplier: LCSC; Type: 1个N沟道; Drain to Source Voltage: 30V; Current - Continuous Drain(Id): 100mA; RDS(on): 8Ω@4.0V,10mA; Pd - Power Dissipation: 200mW; Gate Threshold Voltage (Vgs(th)@Id): 1.5V; Input Capacitance(Ciss@Vds): 13pF; Reverse Transfer Capacitance (Crss@Vds): 4pF; Operating Temperature: -55℃~+150℃
LED1-LED4 = LED_0603-R: Supplier Footprint: 0603
C1 C2 = TAJD107K016RNJ: 容值:100uF;精度:±10%;额定电压:16V;等效串联电阻:600mΩ@100kHz;; LCSC Part Name: 100uF ±10% 16V; Supplier Part: C7223; Manufacturer: Kyocera AVX; Supplier Footprint: CASE-D-7343; JLCPCB Part Class: 扩展库; Datasheet: https://atta.szlcsc.com/upload/public/pdf/source/20160107/1457707750344.pdf; Supplier: LCSC; Tolerance: ±10%; Rated Voltage: 16V; Equivalent Series Resistance(ESR): 600mΩ@100kHz; Operating Temperature: -55℃~+125℃
C3 C4 = FCC0805B104K500DT: 容值:100nF;精度:±10%;额定电压:50V;温度系数:X7R;; LCSC Part Name: 100nF ±10% 50V; Supplier Part: C5137467; Manufacturer: FOJAN(富捷); Supplier Footprint: 0805; Datasheet: https://atta.szlcsc.com/upload/public/pdf/source/20220818/0EB3B7FB2F5648AC16609637FBA7DABE.pdf; Supplier: LCSC; Tolerance: ±10%; Voltage Rating: 50V; Temperature Coefficient: X7R
F1 = SMD1812P150TF/24: 最大电压:24V;最大电流:100A;保持电流:1.5A;跳闸电流:3A;; LCSC Part Name: 24V 1.5A 1812自恢复; Supplier Part: C32404; Manufacturer: RUILON(瑞隆源); Supplier Footprint: 1812; JLCPCB Part Class: 扩展库; Datasheet: https://atta.szlcsc.com/upload/public/pdf/source/20180904/C117855_6683238635D527B90B087B6C3DDDDA27.pdf; Supplier: LCSC; Operating Voltage (Max): 24V; Current Rating (Max): 100A; Hold Current: 1.5A; Trip Current: 3A
L1-L3 = FXL0420-3R3-M: 电感值:3.3uH;精度:±20%;额定电流:3.3A;饱和电流(Isat):4A;类型:一体成型电感;; LCSC Part Name: 3.3uH ±20% 4A; Supplier Part: C167207; Manufacturer: cjiang(长江微电); Supplier Footprint: SMD,4.2x4.4mm; JLCPCB Part Class: 扩展库; Datasheet: https://atta.szlcsc.com/upload/public/pdf/source/20240426/3189EA8206330E2108542F9E34E540E7.pdf; Supplier: LCSC; Tolerance: ±20%; Rated Current: 3.3A; Saturation Current (Isat): 4A; DC Resistance (DCR): 87mΩ; Type: 一体成型电感
R1 = RL1206A180K: 压敏电压:16.8V~21V;钳位电压:46V;工作电压:14V;工作电压(AC):11V;; LCSC Part Name: 钳位电压46V 0.5焦耳 1206压敏电阻; Supplier Part: C2935560; Manufacturer: RUILON(瑞隆源); Supplier Footprint: 1206; JLCPCB Part Class: Extended Part; Datasheet: https://atta.szlcsc.com/upload/public/pdf/source/20240308/73C6904C4907E0B704B240533CDB499D.pdf; Supplier: LCSC; Varistor Voltage: 16.8V~21V; Clamping Voltage: 46V; Maximum DC Volts: 14V; Maximum AC Volts: 11V; Peak Current: 100A; Energy: 0.5J
TP1-TP4 = M3螺丝: Supplier Footprint: 插件
U1 = SS12D07VG4_C22435633: 拨动开关 立式直脚插件两档 VG柄 柄高4mm; Supplier Part: C22435633; Manufacturer: HanElectricity(瀚源); Supplier Footprint: 插件-5P,8.7x4.4mm; JLCPCB Part Class: 扩展库; Datasheet: https://atta.szlcsc.com/upload/public/pdf/source/20240521/1CA194C2B3244F13609074022E313C10.pdf; Supplier: LCSC
U2 = DC005-2.5: 连接器类型:DC电源插座;安装方式:弯插;触点内径:2.5mm;触点外径:6.3mm;额定电流:500mA;额定电压:30V;工作温度范围:-25℃~+70℃;; LCSC Part Name: DC电源插座 内径:2.5mm 外径:6.3mm; Supplier Part: C7507454; Manufacturer: SHOU HAN(首韩); Supplier Footprint: 插件; JLCPCB Part Class: 扩展库; Datasheet: https://atta.szlcsc.com/upload/public/pdf/source/20231013/7634FFE9E6B635EE77C0C008CDC877DB.pdf; Supplier: LCSC; Connector Type: DC电源插座; Mounting Style: 弯插; Inside Contact Diameter: 2.5mm; Outside Contact Diameter: 6.3mm; Current Rating (Max): 500mA; Voltage Rating (Max): 30V; Operating Temperature Range: -25℃~+70℃
U3 = SMAJ13CA_C19077534: 极性:双向;反向截止电压(Vrwm):13V;钳位电压:21.5V;峰值脉冲电流(Ipp):18.6A;峰值脉冲功率(Ppp):400W;击穿电压:15.9V;; Supplier Part: C19077534; Manufacturer: 宏嘉诚; Supplier Footprint: SMA; JLCPCB Part Class: 扩展库; Datasheet: https://atta.szlcsc.com/upload/public/pdf/source/20250107/539D2DC1EE5F9F3FCEFE35DA61E92AD9.pdf; Supplier: LCSC; Polarity: 双向; Reverse Stand-Off Voltage (Vrwm): 13V; Clamping Voltage: 21.5V; Peak Pulse Current (Ipp): 18.6A; Peak Pulse Power Dissipation (Ppp): 400W; Voltage - Breakdown: 15.9V; Reverse Leakage Current (Ir): 1uA; Type: TVS
U4-U6 = TP6327GS6: 功能类型:降压型;输出类型:-;工作电压:3.5V~18V;输出电压:-;输出电流:2.5A;; LCSC Part Name: 18V 3A 600kHz 同步降压转换器; Supplier Part: C2844925; Manufacturer: TECH PUBLIC(台舟); Supplier Footprint: SOT-23-6; JLCPCB Part Class: 扩展库; Datasheet: https://atta.szlcsc.com/upload/public/pdf/source/20210810/090DC3867F1E870FCCF437E7AD17BAB4.pdf; Supplier: LCSC; Function: 降压型; Voltage - Supply: 3.5V~18V; Output Current: 2.5A; Frequency - Switching: 600kHz; Operating Temperature: -40℃~+125℃; Synchronous Rectifier: 是; Number of Outputs: 1; Topology: 降压式
C28 = 0402B104K500NT: 温度系数:X7R;容值:100nF;精度:±10%;额定电压:50V;; LCSC Part Name: 100nF(104) ±10% 50V; Supplier Part: C110251; Manufacturer: FH(风华); Supplier Footprint: 0402; Supplier: LCSC; Temperature Coefficient: X7R; Tolerance: ±10%; Voltage Rated: 50V
LCD1 = ST7789V3-1.47寸焊接: _: 3
R25 = 0402WGF100JTCE: 电阻类型:厚膜电阻;阻值:10Ω;精度:±1%;功率:62.5mW;温度系数:±200ppm/℃;; LCSC Part Name: 厚膜电阻 10Ω ±1% 62.5mW; Supplier Part: C25077; Manufacturer: UNI-ROYAL(厚声); Supplier Footprint: 0402; Datasheet: https://atta.szlcsc.com/upload/public/pdf/source/20200306/C422600_1E6D84923E4A46A82E41ADD87F860B5C.pdf; Supplier: LCSC; Type: 厚膜电阻; Tolerance: ±1%; Power(Watts): 62.5mW; Temperature Coefficient: ±200ppm/℃; Overload Voltage (Max): 50V; Operating Temperature Range: -55℃~+155℃
C30-C47 = 0603CG200J500NT: 容值:20pF;精度:±5%;额定电压:50V;温度系数:C0G;; LCSC Part Name: 20pF ±5% 50V; Supplier Part: C91702; Manufacturer: FH(风华); Supplier Footprint: 0603; Datasheet: https://atta.szlcsc.com/upload/public/pdf/source/20200305/C486355_26A10D38EF8C2A5C37091D0039909270.pdf; Supplier: LCSC; Tolerance: ±5%; Voltage Rating: 50V; Temperature Coefficient: C0G
D2 = 1N4148W_C7420318: 二极管配置:独立式;正向压降(Vf):1.25V@150mA;直流反向耐压(Vr):100V;整流电流:150mA;反向恢复时间(trr):4ns;; Supplier Part: C7420318; Manufacturer: 宏迦橙; Supplier Footprint: SOD-123; Datasheet: https://atta.szlcsc.com/upload/public/pdf/source/20230828/E5C3F7A4272052930A7E03B75759BF50.pdf; Supplier: LCSC; Diode Configuration: 独立式; Forward Voltage (Vf@If): 1.25V@150mA; Reverse Voltage (Vr): 100V; Rectified Current: 150mA; Reverse Leakage Current (Ir): 1uA@75V; Reverse Recovery Time (trr): 4ns; Operating Temperature: -55℃~+150℃
R29 R34-R39 = FRC0603J105 TS: 电阻类型:厚膜电阻;阻值:1MΩ;精度:±5%;功率:100mW;最大工作电压:75V;温度系数:±100ppm/℃;; LCSC Part Name: 1MΩ ±5% 100mW 厚膜电阻; Supplier Part: C2907115; Manufacturer: FOJAN(富捷); Supplier Footprint: 0603; Datasheet: https://atta.szlcsc.com/upload/public/pdf/source/20211221/925EC7D7225764EE0046F22065062C87.pdf; Supplier: LCSC; Type: 厚膜电阻; Tolerance: ±5%; Power(Watts): 100mW; Overload Voltage (Max): 75V; Temperature Coefficient: ±100ppm/℃; Operating Temperature Range: -55℃~+155℃
U8 = USB3320C-EZK: 应用功能:收发器;接口协议:USB 2.0;; LCSC Part Name: USB3320 高度集成全功能高速USB 2.0 ULPI收发器; Supplier Part: C52447; Manufacturer: MICROCHIP(美国微芯); Supplier Footprint: QFN-32-EP(5x5); JLCPCB Part Class: 扩展库; Datasheet: https://atta.szlcsc.com/upload/public/pdf/source/20210326/C52447_82C15BC01EB7B75485FAEA128A6533A1.pdf; Supplier: LCSC; Applications Function: 收发器; Protocol: USB 2.0; Supply Voltage: 1.8V~3.3V; Operating Temperature: -40℃~+85℃
U9 = FE1.1S-BSOP28BCN: 应用功能:-;接口协议:-;; LCSC Part Name: FE1.1s - USB 2.0高速4端口集线器控制器; Supplier Part: C9359; Manufacturer: TERMINUS; Supplier Footprint: SSOP-28-150mil; JLCPCB Part Class: 扩展库; Datasheet: https://atta.szlcsc.com/upload/public/pdf/source/20230317/CF3CD0767291E55840676FE9156E5488.pdf; Supplier: LCSC
U10 = LPW5209AB5F: 类型:高侧开关;通道数:1;输入控制逻辑:高电平有效;工作电压:2.5V~6V;导通电阻:80mΩ;; Supplier Part: C387727; Manufacturer: LOWPOWER(微源半导体); Supplier Footprint: SOT-23-5; JLCPCB Part Class: 扩展库; Datasheet: https://atta.szlcsc.com/upload/public/pdf/source/20190410/C387727_D941FE32588B8E966B3018A3543E5863.pdf; Supplier: LCSC; Type: 高侧开关; Number of Channels: 1; Control Input Logic: 高电平有效; Voltage - Supply: 2.5V~6V; RDS(on): 80mΩ; Operating Temperature	-: -40℃~+85℃
U15 = TS3USB30ERSWR: 开关电路:双刀双掷(DPDT);通道数:1;导通电阻(Ron@VCC):10Ω;; Supplier Part: C73880; Manufacturer: TI(德州仪器); Supplier Footprint: UQFN-10(1.4x1.8); JLCPCB Part Class: 扩展库; Datasheet: https://www.ti.com/cn/lit/gpn/ts3usb30e; Supplier: LCSC; Switch Circuit: 双刀双掷(DPDT); Number of Channels: 1; Supply Voltage: 3V~4.3V; On-State Resistance (Max): 10Ω; Operating Temperature: -40℃~+85℃
USB1 = USB-269-BRW: 连接器类型:Type-A;标准:USB 2.0;公母:母;安装方式:弯插;触点数量:4Px2;端口数量:2;额定电流 - 电源:1.5A;工作温度范围:-20℃~+70℃;; LCSC Part Name: Type-A 母 弯插; Supplier Part: C720548; Manufacturer: XUNPU(讯普); Supplier Footprint: 插件; JLCPCB Part Class: 扩展库; Datasheet: https://atta.szlcsc.com/upload/public/pdf/source/20230927/4A1ED24CE587C5B05C94D6B8B1039B50.pdf; Supplier: LCSC; Connector Type: Type-A; Standard: USB 2.0; Gender: 母; Mounting Style: 弯插; Number of Contacts: 4Px2; Number of Ports: 2; Current Rating - Power (Max): 1.5A; Operating Temperature Range: -20℃~+70℃
USB2 = TYPE-C 16PIN 2MD(073): 连接器类型:Type-C;标准:USB 3.1;公母:母;安装方式:卧贴;触点数量:16P;端口数量:1;额定电流 - 电源:5A;工作温度范围:-25℃~+85℃;; LCSC Part Name: Type-C 母 卧贴; Supplier Part: C2765186; Manufacturer: SHOU HAN(首韩); Supplier Footprint: SMD; Datasheet: https://atta.szlcsc.com/upload/public/pdf/source/20211123/39B17C16241EAC15C5E277BDA434118E.pdf; Supplier: LCSC; Connector Type: Type-C; Standard: USB 3.1; Gender: 母; Mounting Style: 卧贴; Number of Contacts: 16P; Number of Ports: 1; Current Rating - Power (Max): 5A; Operating Temperature Range: -25℃~+85℃; Rated Voltage (Max): 5V; Connect-Disconnect Life: 5千次; Core Colour: 黑色
X1 = X322524MSB4SI: 晶振类型:贴片晶振;频率:24MHz;常温频差:±10ppm;外接负载电容:20pF;频率稳定度(全温):±20ppm;; LCSC Part Name: 24MHz ±10ppm 20pF; Supplier Part: C15643; Manufacturer: YXC(扬兴晶振); Supplier Footprint: SMD3225-4P; JLCPCB Part Class: 扩展库; Datasheet: https://atta.szlcsc.com/upload/public/pdf/source/20240329/19D5F850207469550BEB00D7DFEDBC7A.pdf; Supplier: LCSC; Crystal Type: 贴片晶振; Normal temperature Frequency Tolerance: ±10ppm; External load capacitor: 20pF; Frequency Stability(Full temperature range): ±20ppm; Operating Temperature: -40℃~+85℃
X2 = X322512MSB4SI: 晶振类型:贴片晶振;频率:12MHz;常温频差:±10ppm;外接负载电容:20pF;频率稳定度(全温):±20ppm;; LCSC Part Name: 12MHz ±10ppm 20pF; Supplier Part: C9002; Manufacturer: YXC(扬兴晶振); Supplier Footprint: SMD3225-4P; JLCPCB Part Class: 基础库; Datasheet: https://atta.szlcsc.com/upload/public/pdf/source/20240329/19D5F850207469550BEB00D7DFEDBC7A.pdf; Supplier: LCSC; Crystal Type: 贴片晶振; Normal temperature Frequency Tolerance: ±10ppm; External load capacitor: 20pF; Frequency Stability(Full temperature range): ±20ppm; Operating Temperature: -40℃~+85℃
CN1 CN2 = IPCB08371FA0S7V: PIN总数:100P;间距:0.8mm;安装方式:立贴;行数:2;; LCSC Part Name: PIN:100P 间距:0.8mm 立贴; Supplier Part: C22461415; Manufacturer: INCP; Supplier Footprint: SMD,P=0.8mm; JLCPCB Part Class: 扩展库; Datasheet: https://atta.szlcsc.com/upload/public/pdf/source/20240619/5D69887FAE09D9D57C424B6E908E5756.pdf; Supplier: LCSC; Number of Pins: 100P; Pitch: 0.8mm; Mounting Style: 立贴; Number of Rows: 2; Contact Material: 磷青铜
H2 = PZ254V-11-04P: 插针结构:1x4P;间距:2.54mm;行距:-;圆针/方针:方针;安装类型:直插;排数:单排;总PIN位数:4P;额定电流:3A;额定电压:250V;配合针长度:6mm;塑高:2.5mm;端接针长度:3mm;触头材质:-;工作温度范围:-40℃~+105℃;颜色:黑色;; LCSC Part Name: 间距:2.54mm 1x4P 直插 方针; Supplier Part: C2691448; Manufacturer: XFCN(兴飞); Supplier Footprint: 插件,P=2.54mm; JLCPCB Part Class: 扩展库; Datasheet: https://atta.szlcsc.com/upload/public/pdf/source/20200309/C492403_F9F19131791D08044AD4F84F8E751A34.pdf; Supplier: LCSC; Pin Structure: 1x4P; Pitch: 2.54mm; Circluar Pins/Square Pins: 方针; Mounting Type: 直插; Number of Rows: 单排; Number of Pins: 4P; Current Rating (Max): 3A; Voltage Rating (Max): 250V; Length of Mating Pin: 6mm; Insulation Height: 2.5mm; Length of End Connection Pin: 3mm; Operating Temperature Range: -40℃~+105℃; Color: 黑色
U16 = PZ2.54-2*20: 插针结构:2x20P;间距:2.54mm;安装方式:直插;排数:双排;总PIN位数:40P;触头镀层:金;; LCSC Part Name: 2x20P 间距:2.54mm 直插; Supplier Part: C5224014; Manufacturer: ZHOURI(洲日); Supplier Footprint: 插件,P=2.54mm; JLCPCB Part Class: 扩展库; Datasheet: https://atta.szlcsc.com/upload/public/pdf/source/20221102/7E8316C38DB6D81BB18273F4CFF8B2F6.pdf; Supplier: LCSC; Pin Structure: 2x20P; Pitch: 2.54mm; Mounting Type: 直插; Number of Rows: 双排; Number of Pins: 40P; Contact Plating: 金

## Nets
1V8: C18.2 C19.2 L3.2 R8.2 R28.2 U8.8(REFSEL0) U8.11(REFSEL1) U8.14(REFSEL2) U8.28(VDD18) U8.30(VDD18) U8.32(VDDIO)
3V3: C13.2 C14.2 C20.2 C28.1 C47.1 D3.2(A) H2.4 L2.2 LCD1.4(VDD) LED1.2(A) R5.2 R11.2 R14.1 R17.1 R20.1 R23.1 R25.1 R56.2 R58.2 R60.2 RJ1.12 RJ1.14 U7.2(3V3) U8.21(VBAT) U12.1(G) U13.1(G) U14.1(G) U15.9(VCC)
5V: C8.2 C9.2 C30.1 C32.2 C39.1 C40.2 C46.1 C48.2 CN2.93 CN2.94 CN2.95 CN2.96 CN2.97 CN2.98 CN2.99 CN2.100 D6.2 HDMI1.18(+5VPower) L1.2 R3.2 R34.1 R37.2 R57.2 R59.2 R62.2 U9.20(VDD5) U10.5(VIN) USB1.1(VBUS) USB1.5(VBUS)
12V: C1.1 C2.1 C3.2 C4.2 C6.2 C7.2 C11.2 C12.2 C16.2 C17.2 F1.2 R1.2 U4.3(IN) U4.5(EN) U5.3(IN) U5.5(EN) U6.3(IN) U6.5(EN)
GND: C1.2 C2.2 C3.1 C4.1 C6.1 C7.1 C8.1 C9.1 C11.1 C12.1 C13.1 C14.1 C16.1 C17.1 C18.1 C19.1 C20.1 C21.1 C22.1 C23.1 C24.1 C25.1 C26.1 C27.1 C28.2 C29.2 C30.2 C31.1 C32.1 C33.1 C34.1 C35.1 C36.2 C37.2 C38.2 C39.2 C40.1 C41.2 C42.2 C43.2 C44.2 C45.2 C46.2 C47.2 C48.1 CN1.13 CN1.15 CN1.16 CN1.17 CN1.18 CN1.19 CN1.20 CN1.21 CN1.22 CN1.23 CN1.24 CN1.25 CN1.38 CN1.39 CN1.89 CN1.90 CN2.1 CN2.2 CN2.3 CN2.4 CN2.5 CN2.6 CN2.7 CN2.8 CN2.32 CN2.41 CN2.50 CN2.59 CN2.68 CN2.81 D4.3(GND) D4.8(GND) D5.3(GND) D5.8(GND) D6.1 D7.1 D8.1 D9.1 D10.1 H1.5 H2.3 HDMI1.2(TMDSData2Shield) HDMI1.5(TMDSData1Shield) HDMI1.8(TMDSData0Shield) HDMI1.11(TMDSClockShield) HDMI1.17(DDC/CECGround) LCD1.1(GND) LCD1.2(LEDK) LCD1.5(GND2) LCD1.6(GND3) LCD1.12(GND4) R1.1 R4.1 R6.1 R9.1 R10.1 R16.1 R19.1 R22.1 R31.2 R33.2 R38.1 R39.2 R41.1 R42.1 R44.2 R54.1 R55.1 R63.2 RJ1.10 RJ1.15(SH) RJ1.16(SH) SW1.1 SW1.2 SW2.1 SW2.2 SW3.3 SW3.4 SW4.3 SW4.4 SW5.3 SW5.4 SW6.3 SW6.4 TP1.1 TP2.1 TP3.1 TP4.1 U1.4 U1.5 U2.2 U2.3 U3.1 U4.1(GND) U5.1(GND) U6.1(GND) U7.1(GND) U7.40(GND) U7.41(GND) U8.33(GND) U9.1(VSS) U10.2(GND) U15.4(GND) U15.8(OE#) U16.5 U16.6 U16.37 U16.38 U16.39 U16.40 USB1.4(GND) USB1.8(GND) USB1.9(GND) USB1.10(GND) USB1.11(GND) USB1.12(GND) USB2.1(GND) USB2.12(GND) USB2.13(SHELL) USB2.14(SHELL) X1.2(GND) X1.4(GND) X2.2(GND) X2.4(GND)
VBUS_EN: R41.2 U8.17(CPEN) U10.4(EN)
BK13_T5: CN2.12 U16.34
BK13_T9: CN2.28 U16.20
BK13_U5: CN2.14 U16.33
BK13_U7: CN2.16 U16.31
BK13_U8: CN2.24 U16.23
BK13_U9: CN2.26 U16.21
BK13_U10: CN2.30
BK13_V5: CN2.11 U16.36
BK13_V6: CN2.13 U16.35
BK13_V7: CN2.18 U16.29
BK13_V8: CN2.20 U16.27
BK13_V10: CN2.29
BK13_V11: CN2.31
BK13_W6: CN2.15 U16.32
BK13_W8: CN2.22 U16.25
BK13_W9: CN2.25 U16.22
BK13_W10: CN2.27 U16.19
BK13_W11: CN2.37
BK13_Y6: CN2.17 U16.30
BK13_Y7: CN2.19 U16.28
BK13_Y8: CN2.21 U16.26
BK13_Y9: CN2.23 U16.24
BK13_Y11: CN2.39
BK13_Y12: CN2.33
BK13_Y13: CN2.35
BK34_IO_25--T19: CN2.85
BK34_L1_N--T10: CN2.34
BK34_L1_P--T11: CN2.36
BK34_L2_N--U12: CN2.40
BK34_L2_P--T12: CN2.38
BK34_L4_N--W14: CN2.45
BK34_L4_P--V13: CN2.43
BK34_L5_N--T15: CN2.58
BK34_L5_P--T14: CN2.56
BK34_L6_N--R14: CN2.44
BK34_L6_P--P14: CN2.42
BK34_L7_N--Y17: CN2.61 U7.13(IO19)
BK34_L7_P--Y16: CN2.63 U7.12(IO8)
BK34_L8_N--Y15: CN2.49
BK34_L8_P--W15: CN2.47
BK34_L9_N--U17: CN2.62
BK34_L9_P--T16: CN2.60
BK34_L10_N--W16: CN2.53
BK34_L10_P--V16: CN2.51
BK34_L11_N--U15: CN2.54
BK34_L11_P--U14: CN2.52
BK34_L16_N--W20: CN2.77 U7.5(IO5)
BK34_L16_P--V20: CN2.79 U7.4(IO4)
BK34_L17_N--Y19: CN2.71 U7.8(IO15)
BK34_L17_P--Y18: CN2.69 U7.9(IO16)
BK34_L18_N--W17: CN2.57
BK34_L18_P--V17: CN2.55
BK34_L20_N--R18: CN2.66
BK34_L20_P--T17: CN2.64
BK34_L21_N--V18: CN2.67 U7.10(IO17)
BK34_L21_P--V17: CN2.65 U7.11(IO18)
BK34_L22_N--W19: CN2.75 U7.6(IO6)
BK34_L22_P--W18: CN2.73 U7.7(IO7)
BK34_L24_P--P15: CN2.70
BK34_U13: CN2.46
BK34_U19: CN2.83
BK34_V13: CN2.48
BK35_A20: CN1.66
BK35_B19: CN1.68
BK35_B20: CN1.67
BK35_C20: CN1.70
BK35_D18: CN1.69
BK35_D19: CN1.55 U16.17
BK35_D20: CN1.72
BK35_E17: CN1.53 U16.18
BK35_E18: CN1.54
BK35_E19: CN1.73
BK35_F16: CN1.51 U16.15
BK35_F17: CN1.52
BK35_F19: CN1.42 R18.1
BK35_F20: CN1.43 U16.11
BK35_G15: CN1.71
BK35_G17: CN1.40 LED3.2(A)
BK35_G18: CN1.41 U16.12
BK35_G19: CN1.44 LED2.2(A)
BK35_G20: CN1.76
BK35_H15: CN1.74
BK35_H16: CN1.50
BK35_H17: CN1.56
BK35_H18: CN1.45 U16.14
BK35_H20: CN1.78
BK35_IO_0--G14: CN1.49 U16.16
BK35_IO_25--J15: CN1.46 R15.1
BK35_J14: CN1.47 U16.13
BK35_J18: CN1.58
BK35_J19: CN1.60
BK35_J20: CN1.80
BK35_K14: CN1.75
BK35_K17: CN1.57
BK35_K18: CN1.59
BK35_K19: CN1.61
BK35_L14: CN1.77
BK35_L15: CN1.65
BK35_L16: CN1.64
BK35_L17: CN1.63
BK35_L19: CN1.62
BK35_L20: CN1.83
BK35_M14: CN1.79
BK35_M15: CN1.81
BK35_M17: CN1.88
BK35_M18: CN1.87
BK35_M19: CN1.86
BK35_M20: CN1.85
BK35_N15: CN1.82
BK35_N16: CN1.84
CHIP_PU: C21.2 C23.2 Q1.3(C) R11.1 SW2.3 U7.3(EN)
DM1: U9.10(DM1) USB1.2(D-)
DM2: U9.8(DM2) USB1.6(D-)
DP1: U9.11(DP1) USB1.3(D+)
DP2: U9.9(DP2) USB1.7(D+)
DTR: H1.3 Q2.2(E) R12.2
FPGA_TCK: CN1.2 U16.1
FPGA_TDI: CN1.3 U16.4
FPGA_TDO: CN1.4 U16.2
FPGA_TMS: CN1.1 U16.3
GPIO0: C22.2 Q2.3(C) SW1.3 U7.27(IO0)
HDMI_CEC_A: CN2.78 R58.1 U13.2(S)
HDMI_CEC_CON: D9.2 HDMI1.13(CEC) R53.1 R59.1 U13.3(D)
HDMI_HPD: CN2.76 R61.2 R63.1
HDMI_HPD_CON: D10.2 HDMI1.19(HotPlugDetect) R54.2 R61.1
HDMI_SCL_CON: D7.2 HDMI1.15(SCL) R62.1 U14.3(D)
HDMI_SDA_CON: D8.2 HDMI1.16(SDA) R57.1 U12.3(D)
HDMI_TX0_N: CN2.80 D5.2(I/O2) D5.9(NC) HDMI1.9(TMDSData0-) R50.1
HDMI_TX0_P: CN2.82 D5.1(I/O1) D5.10(NC) HDMI1.7(TMDSData0+) R49.1
HDMI_TX1_N: CN2.84 D4.5(I/O4) D4.6(NC) HDMI1.6(TMDSData1-) R48.1
HDMI_TX1_P: CN2.86 D4.4(I/O3) D4.7(NC) HDMI1.4(TMDSData1+) R47.1
HDMI_TX2_N: CN2.88 D4.2(I/O2) D4.9(NC) HDMI1.3(TMDSData2-) R46.1
HDMI_TX2_P: CN2.90 D4.1(I/O1) D4.10(NC) HDMI1.1(TMDSData2+) R45.1
HDMI_TXC_N: CN2.89 D5.5(I/O4) D5.6(NC) HDMI1.12(TMDSClock-) R52.1
HDMI_TXC_P: CN2.87 D5.4(I/O3) D5.7(NC) HDMI1.10(TMDSClock+) R51.1
HOST_DM: U9.15(DMU) U15.7(D1-)
HOST_DP: U9.16(DPU) U15.1(D1+)
HUB_1V8: C36.1 C41.1 U9.12(NC) U9.28(NC)
HUB_3V3: C38.1 C42.1 R35.1 R36.1 U9.13(NC) U9.21(VD33F)
I2C_SCL: CN2.72 R60.1 U14.2(S)
I2C_SDA: CN2.74 R56.1 U12.2(S)
LCD_CS: LCD1.8(CS)
LCD_DC: LCD1.7(D/C)
LCD_MOSI: LCD1.10(SDA)
LCD_RESET: LCD1.11(RES)
LCD_SCK: LCD1.9(SCL)
OTG_DM: U8.19(DM) U15.5(D-)
OTG_DP: U8.18(DP) U15.3(D+)
PHY_LED0: CN1.100 R27.2
PHY_LED1: CN1.99 R26.2
PHY_MDI0_N: CN1.96 RJ1.3
PHY_MDI0_P: CN1.98 RJ1.2
PHY_MDI1_N: CN1.92 RJ1.7
PHY_MDI1_P: CN1.94 RJ1.4
PHY_MDI2_N: CN1.95 RJ1.6
PHY_MDI2_P: CN1.97 RJ1.5
PHY_MDI3_N: CN1.91 RJ1.9
PHY_MDI3_P: CN1.93 RJ1.8
PS500_MIO7: CN1.9 U16.10
PS500_MIO8: CN1.6 R24.1
PS500_MIO9: CN1.5 U16.8
PS500_MIO10: CN1.10 LED4.2(A)
PS500_MIO11: CN1.7 U16.7
PS500_MIO12: CN1.11 U16.9
PS500_MIO13: CN1.8 R21.1
PS500_MIO14_UART_RXD: CN1.12 H2.2
PS500_MIO15_UART_TXD: CN1.14 H2.1
PS501_MIO28_OTG_D4: CN1.35 U8.7(DATA4)
PS501_MIO29_OTG_DIR: CN1.32 U8.31(DIR)
PS501_MIO30_OTG_STP: CN1.34 U8.29(STP)
PS501_MIO31_OTG_NXT: CN1.36 U8.2(NXT)
PS501_MIO32_OTG_D0: CN1.31 U8.3(DATA0)
PS501_MIO33_OTG_D1: CN1.33 U8.4(DATA1)
PS501_MIO34_OTG_D2: CN1.29 U8.5(DATA2)
PS501_MIO35_OTG_D3: CN1.26 U8.6(DATA3)
PS501_MIO36_OTG_CLK: CN1.30 R30.1
PS501_MIO37_OTG_D5: CN1.27 U8.9(DATA5)
PS501_MIO38_OTG_D6: CN1.28 U8.10(DATA6)
PS501_MIO39_OTG_D7: CN1.37 U8.13(DATA7)
RTS: H1.4 Q1.2(E) R13.2
SLAVE_5V: D2.1(A) R32.2 R43.2 USB2.2(VBUS) USB2.11(VBUS)
SLAVE_DM: U15.6(D2-) USB2.5(DN2) USB2.7(DN1)
SLAVE_DP: U15.2(D2+) USB2.6(DP1) USB2.8(DP2)
U0_RXD: H1.1 U7.36(RXD0)
U0_TXD: H1.2 U7.37(TXD0)
USB_RST: CN1.48 D1.1(K)
USB_VBUS: R40.2 U8.22(VBUS)
XIN: C44.1 U9.3(XIN) X2.1(OSC1)
XOUT: C45.1 U9.2(XOUT) X2.3(OSC2)
$1N722: R2.1 R4.2 U4.4(FB)
$1N812: C5.2 L1.1 U4.2(SW)
$1N829: C5.1 U4.6(Boot)
$1N1950: C10.2 L2.1 U5.2(SW)
$1N1951: C10.1 U5.6(Boot)
$1N1959: R5.1 R6.2 U5.4(FB)
$1N2404: C15.2 L3.1 U6.2(SW)
$1N2405: C15.1 U6.6(Boot)
$1N2413: R7.1 R9.2 U6.4(FB)
$1N2483: R2.2 R3.1
$1N2536: R7.2 R8.1
$1N2879: U1.2 U2.4
$1N2952: F1.1 U1.1 U3.2
$1N3815: LED1.1(C) R10.2
$2N1180: Q1.1(B) R12.1
$2N1190: Q2.1(B) R13.1
$2N3028: H3.1 U7.15(IO3)
$2N3030: H3.2 U7.16(IO46)
$2N3032: H3.3 U7.17(IO9)
$2N3034: H3.4 U7.18(IO10)
$2N3036: H3.5 U7.19(IO11)
$2N3038: H3.6 U7.20(IO12)
$2N3040: H3.7 U7.21(IO13)
$2N3042: H3.8 U7.22(IO14)
$2N3044: H3.9 U7.23(IO21)
$2N3046: H3.10 U7.24(IO47)
$2N3048: H3.11 U7.25(IO48)
$2N3050: H3.12 U7.26(IO45)
$4N448: C29.1 RJ1.1
$4N794: R26.1 RJ1.13
$4N815: R27.1 RJ1.11
$5N566: C31.2 D1.2(A) R28.1 U8.27(RESETB)
$5N848: C33.2 R29.2 U8.25(XO) X1.3(OSC2)
$5N1007: R32.1 R33.1 U8.23(ID)
$5N1177: C35.2 U8.20(VDD33)
$5N1271: R31.1 U8.24(RBIAS)
$5N1557: R30.2 U8.1(CLKOUT)
$5N1979: R42.2 U10.3(ISET)
$5N2001: C43.1 D2.2(K) R40.1 U10.1(VOUT)
$5N2909: R43.1 R44.1 U15.10(S)
$5N4665: C34.2 R29.1 U8.26(REFCLK) X1.1(OSC1)
$5N5954: R39.1 U9.14(REXT)
$5N6238: C37.1 R34.2 U9.26(OVCJ)
$5N6672: R37.1 R38.2 U9.18(VBUSM)
$5N6734: R35.2 U9.19(BUSJ)
$5N6789: R36.2 U9.17(XRSTJ)
$6N2187: D3.1(K) R45.2 R46.2 R47.2 R48.2 R49.2 R50.2 R51.2 R52.2 R53.2
$6N2561: HDMI1.20(EH) R55.2
$8N451: C24.2 R15.2 SW3.2
$8N591: R14.2 SW3.1
$8N813: C25.2 R18.2 SW4.2
$8N821: R17.2 SW4.1
$8N1019: C26.2 R21.2 SW5.2
$8N1027: R20.2 SW5.1
$8N1225: C27.2 R24.2 SW6.2
$8N1233: R23.2 SW6.1
$8N1329: LED2.1(C) R16.2
$8N1424: LED3.1(C) R19.2
$8N1519: LED4.1(C) R22.2
Net-(LCD1-3): LCD1.3(LEDA) R25.2

Not connected (* = marked no-connect by the designer): CN2 9* 10* 91* 92*; HDMI1 14(Reserved(N.C.))*; SW1 4*; SW2 4*; U1 3*; U7 14(IO20)* 28(IO35)* 29(IO36)* 30(IO37)* 31(IO38)* 32(IO39)* 33(IO40)* 34(IO41)* 35(IO42)* 38(IO2)* 39(IO1)*; U8 12(N/C)* 15(SPK_L)* 16(SPK_R)*; U9 4(DM4)* 5(DP4)* 6(DM3)* 7(DP3)* 22(DRV)* 23(LED1)* 24(LED2)* 25(PWRJ)* 27(TESTJ)*; USB2 3(SBU2)* 4(CC1)* 9(SBU1)* 10(CC2)*

## Notes on the sheets
sheet 2
- BOOT
sheet 3
- PS:19
- BK13: 25
- BK35_K16
- BK35: 49
- BK34: 49
- BK34_L19_P--R16
- BK34_L24_N--P16
- BK34_L19_N--R17
- BK34_IO_0--R19
- BK34_L23_N--P18
- BK34_L23_P--N17
- BK34_L13_N--P19
- BK34_L13_P--N18
- BK34_L15_P--T20
- BK34_L14_N--P20
- BK34_L15_N--U20
- BK34_L14_P--N20
sheet 5
- 默认主机模式
  当从机USB接口连接PC时自动切换为从机模式
